# EAGLE design controller (EAGLE 9.6.0)
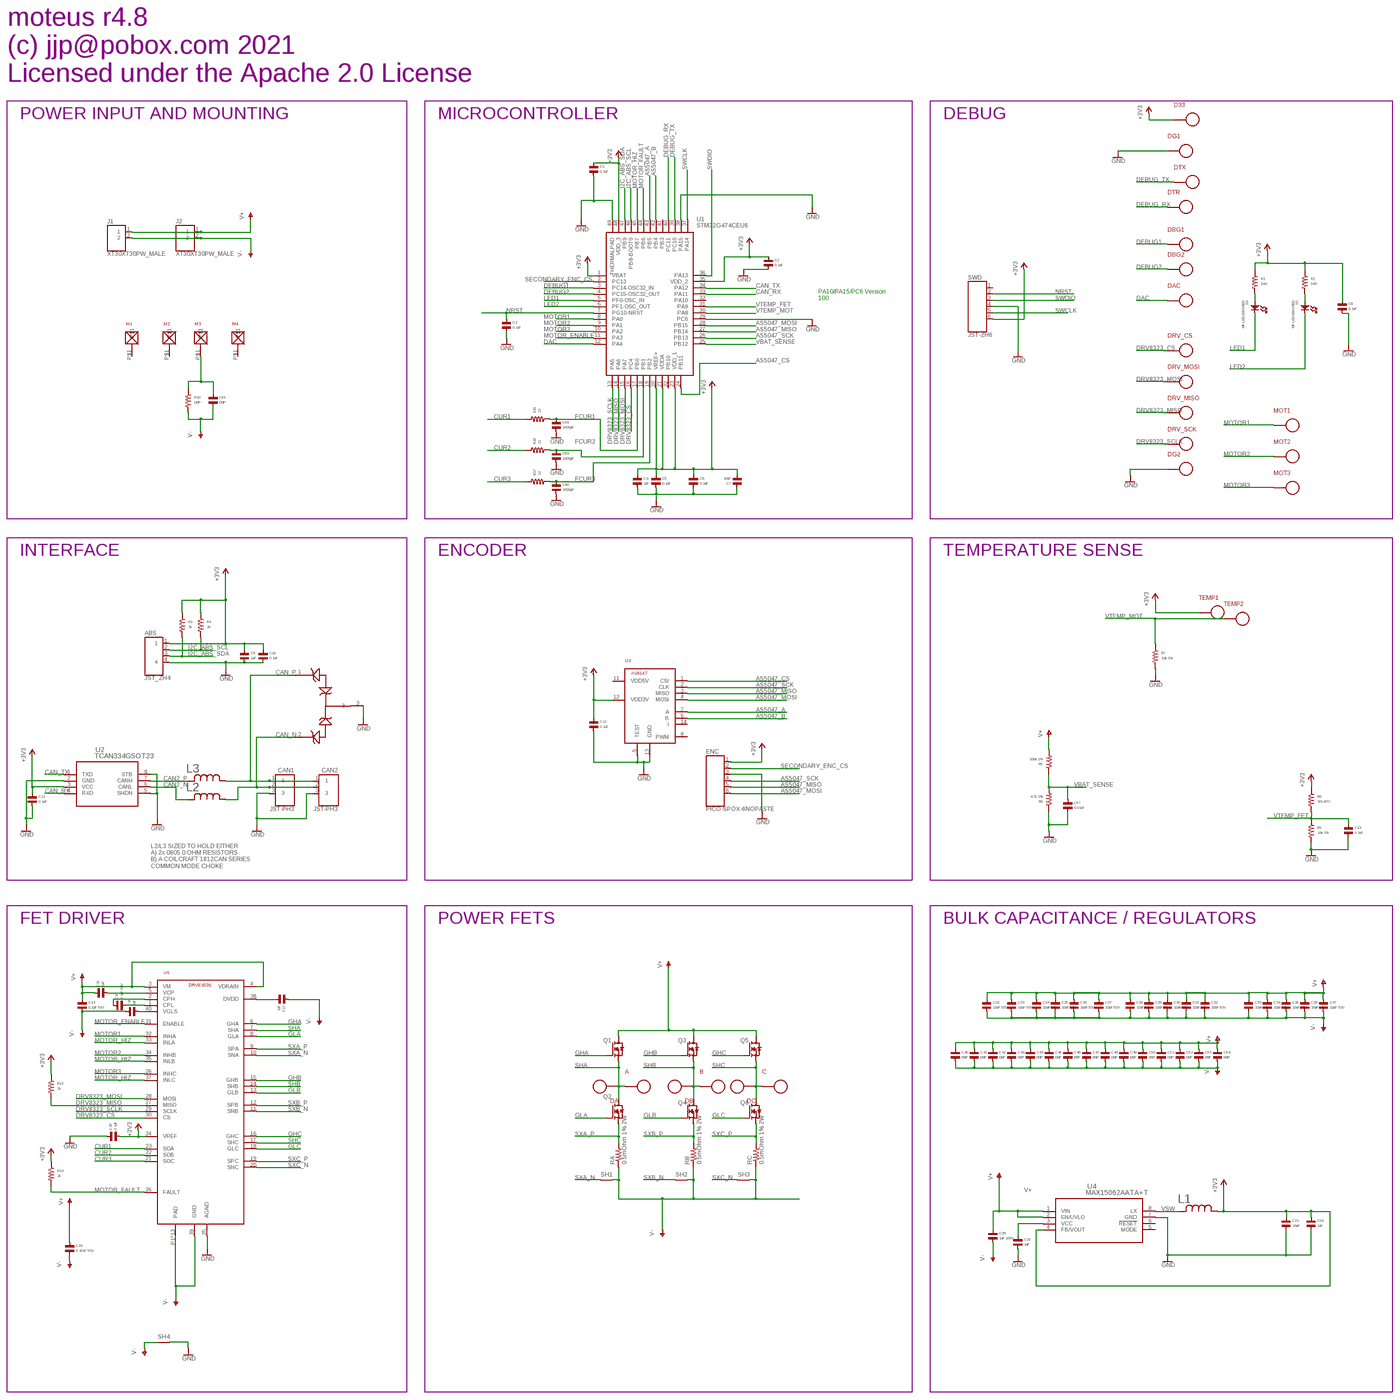
[diagram p0: schematic, sheet 1, overview]
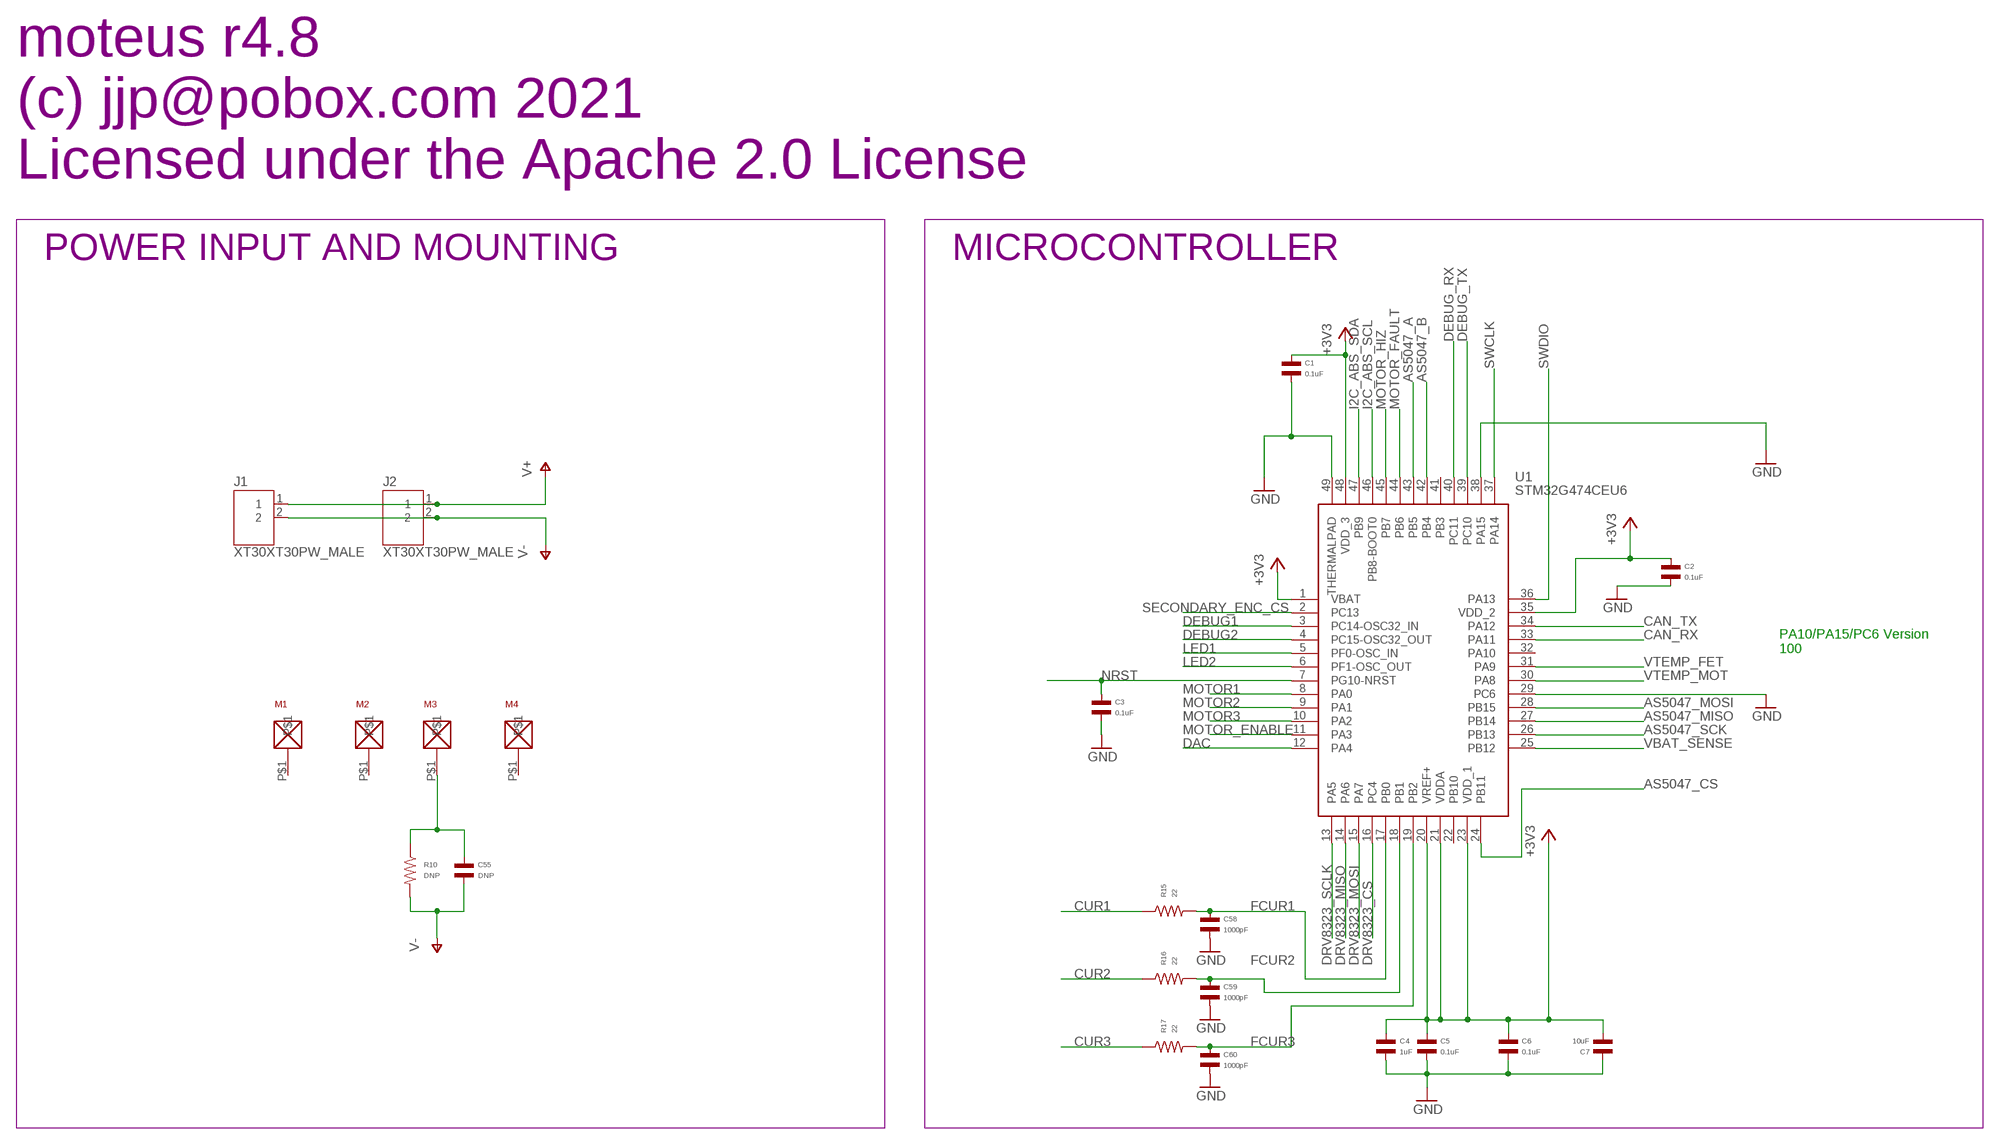
[diagram p1: schematic, sheet 1, part 1 of 4]
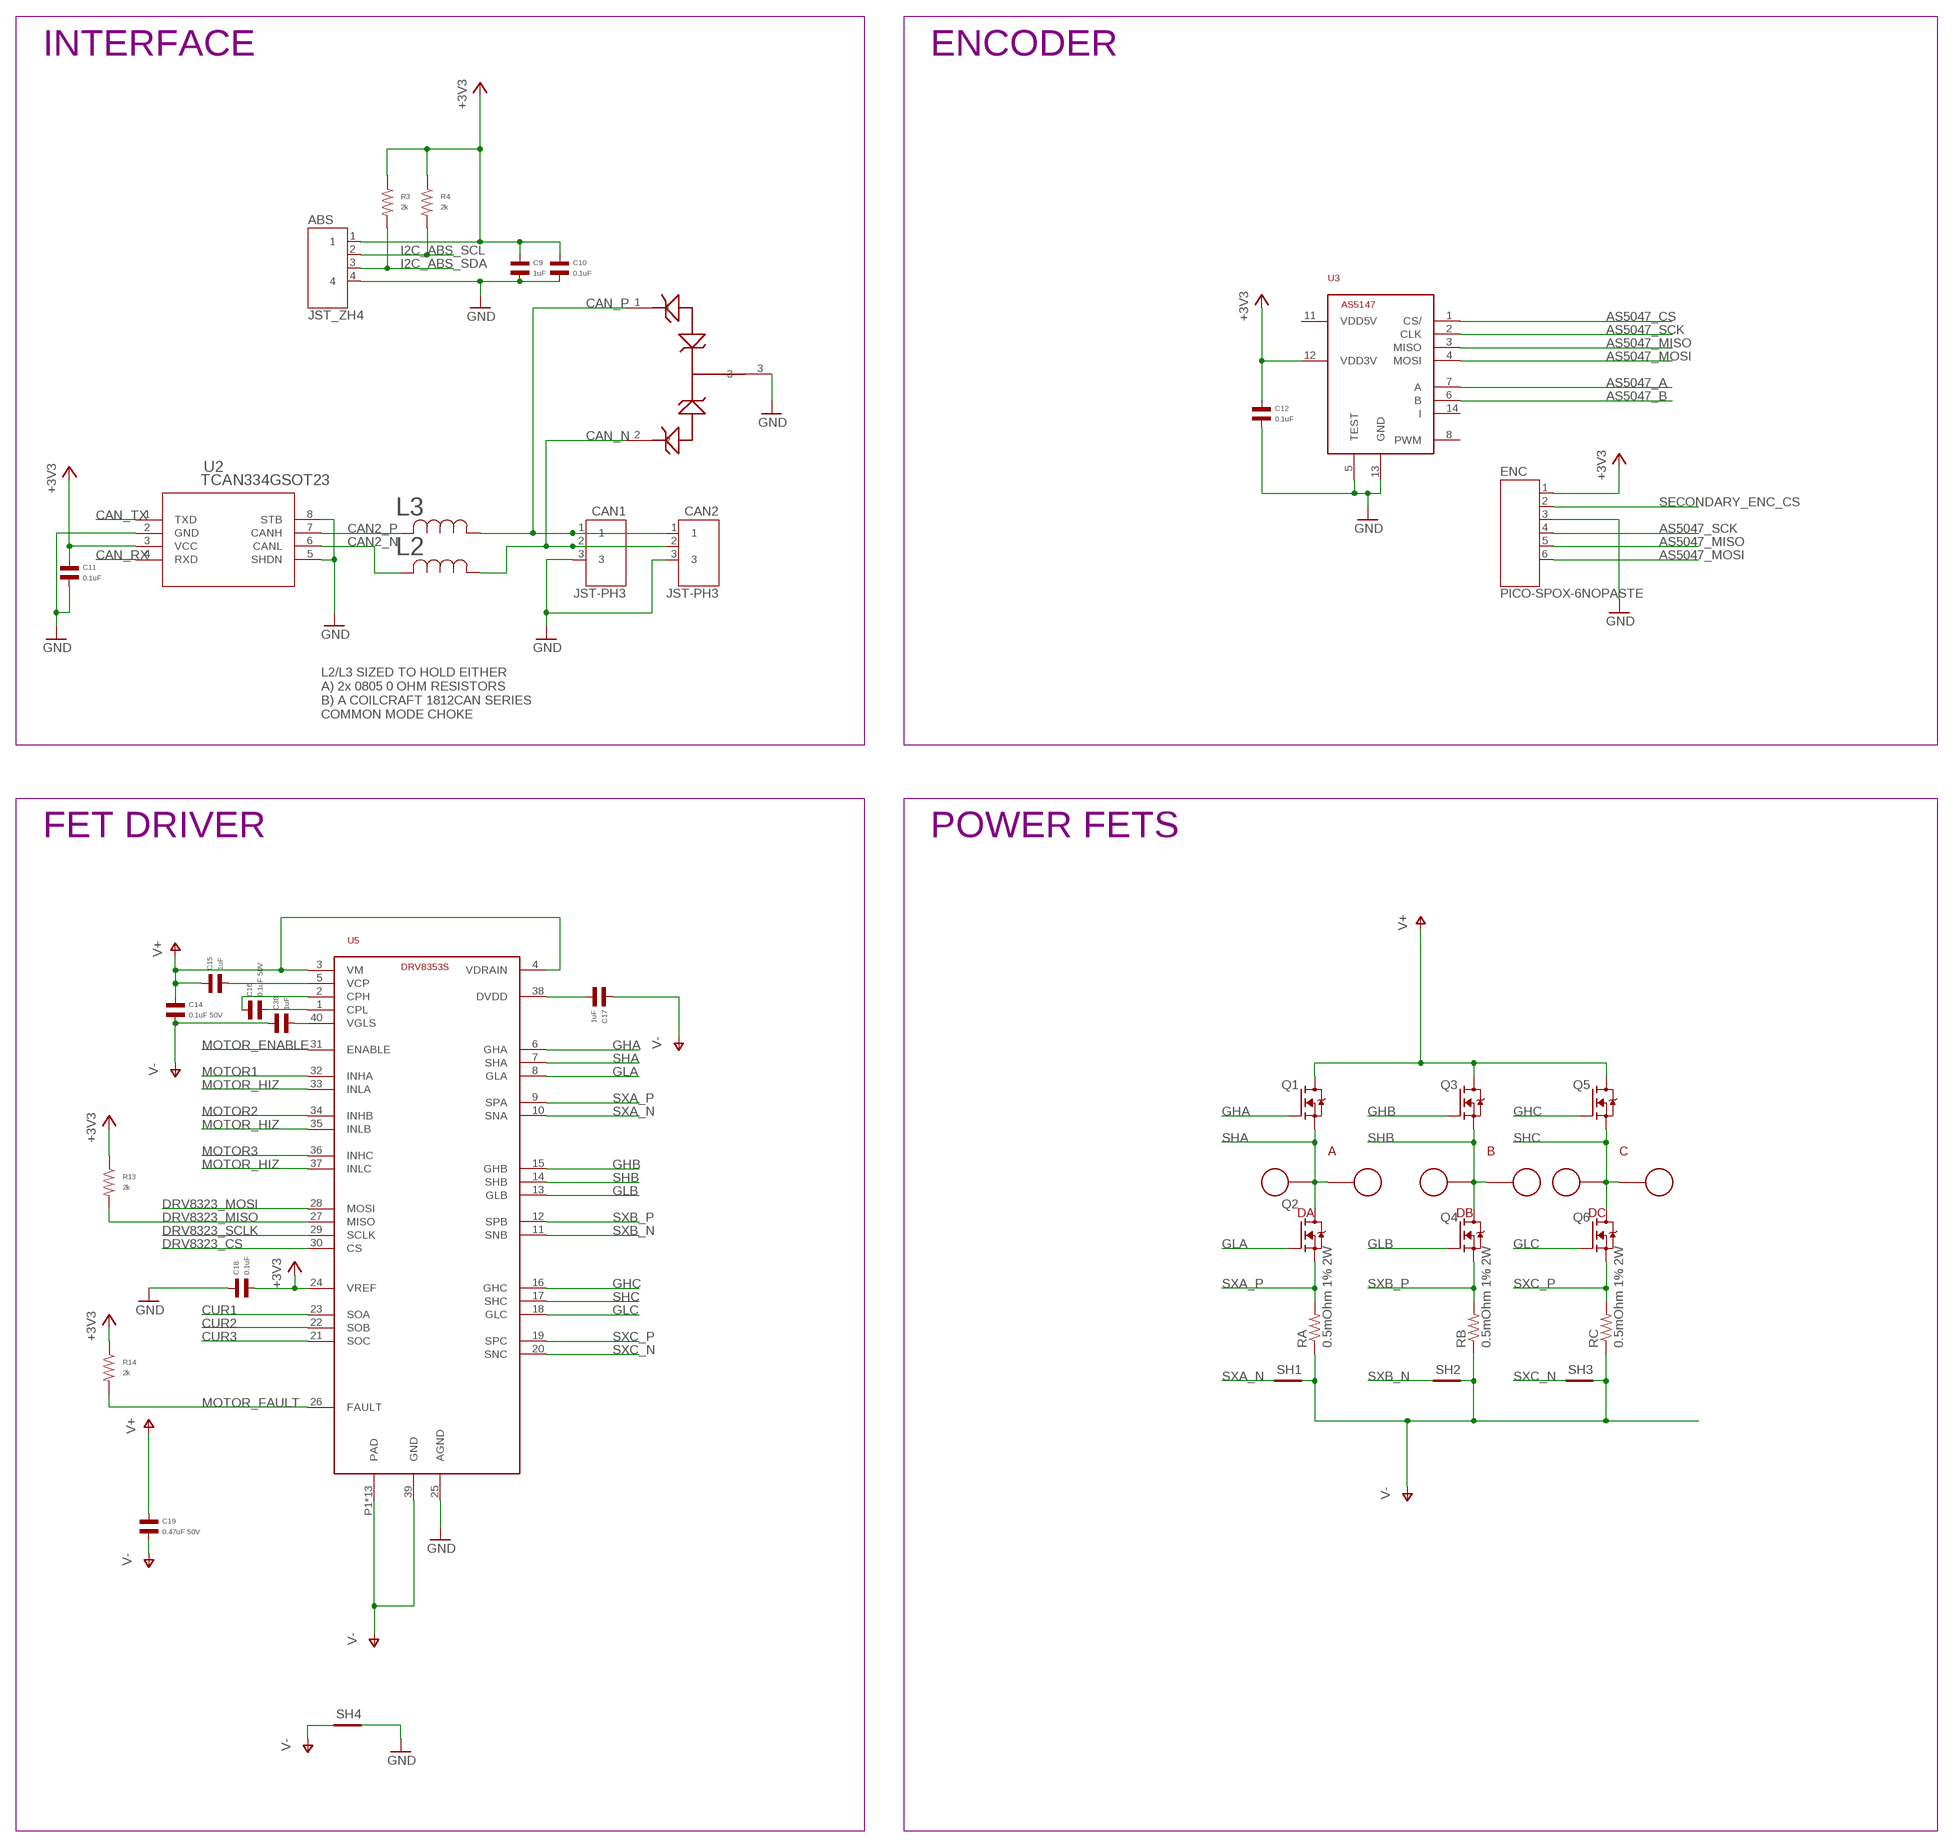
[diagram p2: schematic, sheet 1, part 2 of 4]
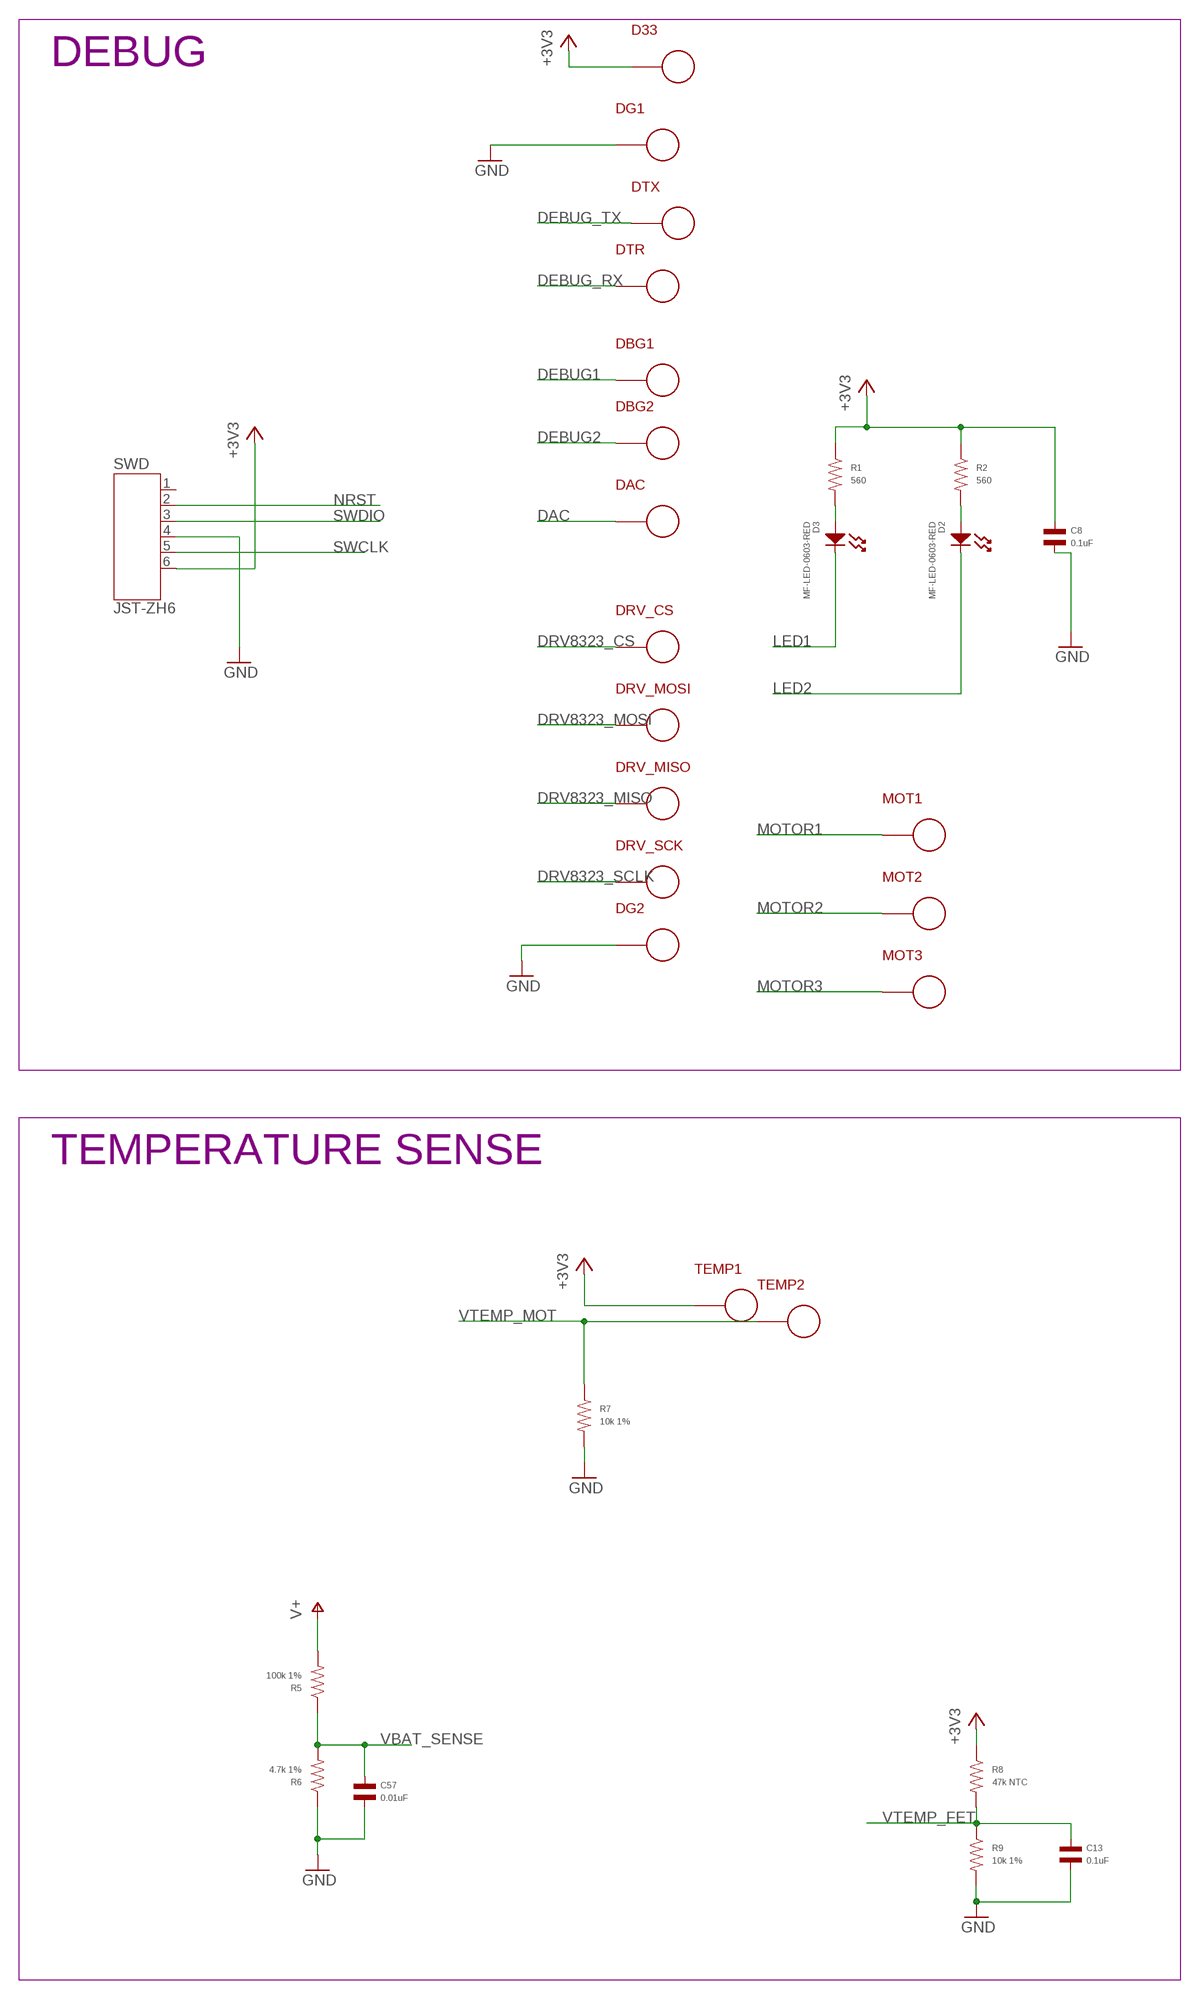
[diagram p3: schematic, sheet 1, part 3 of 4]
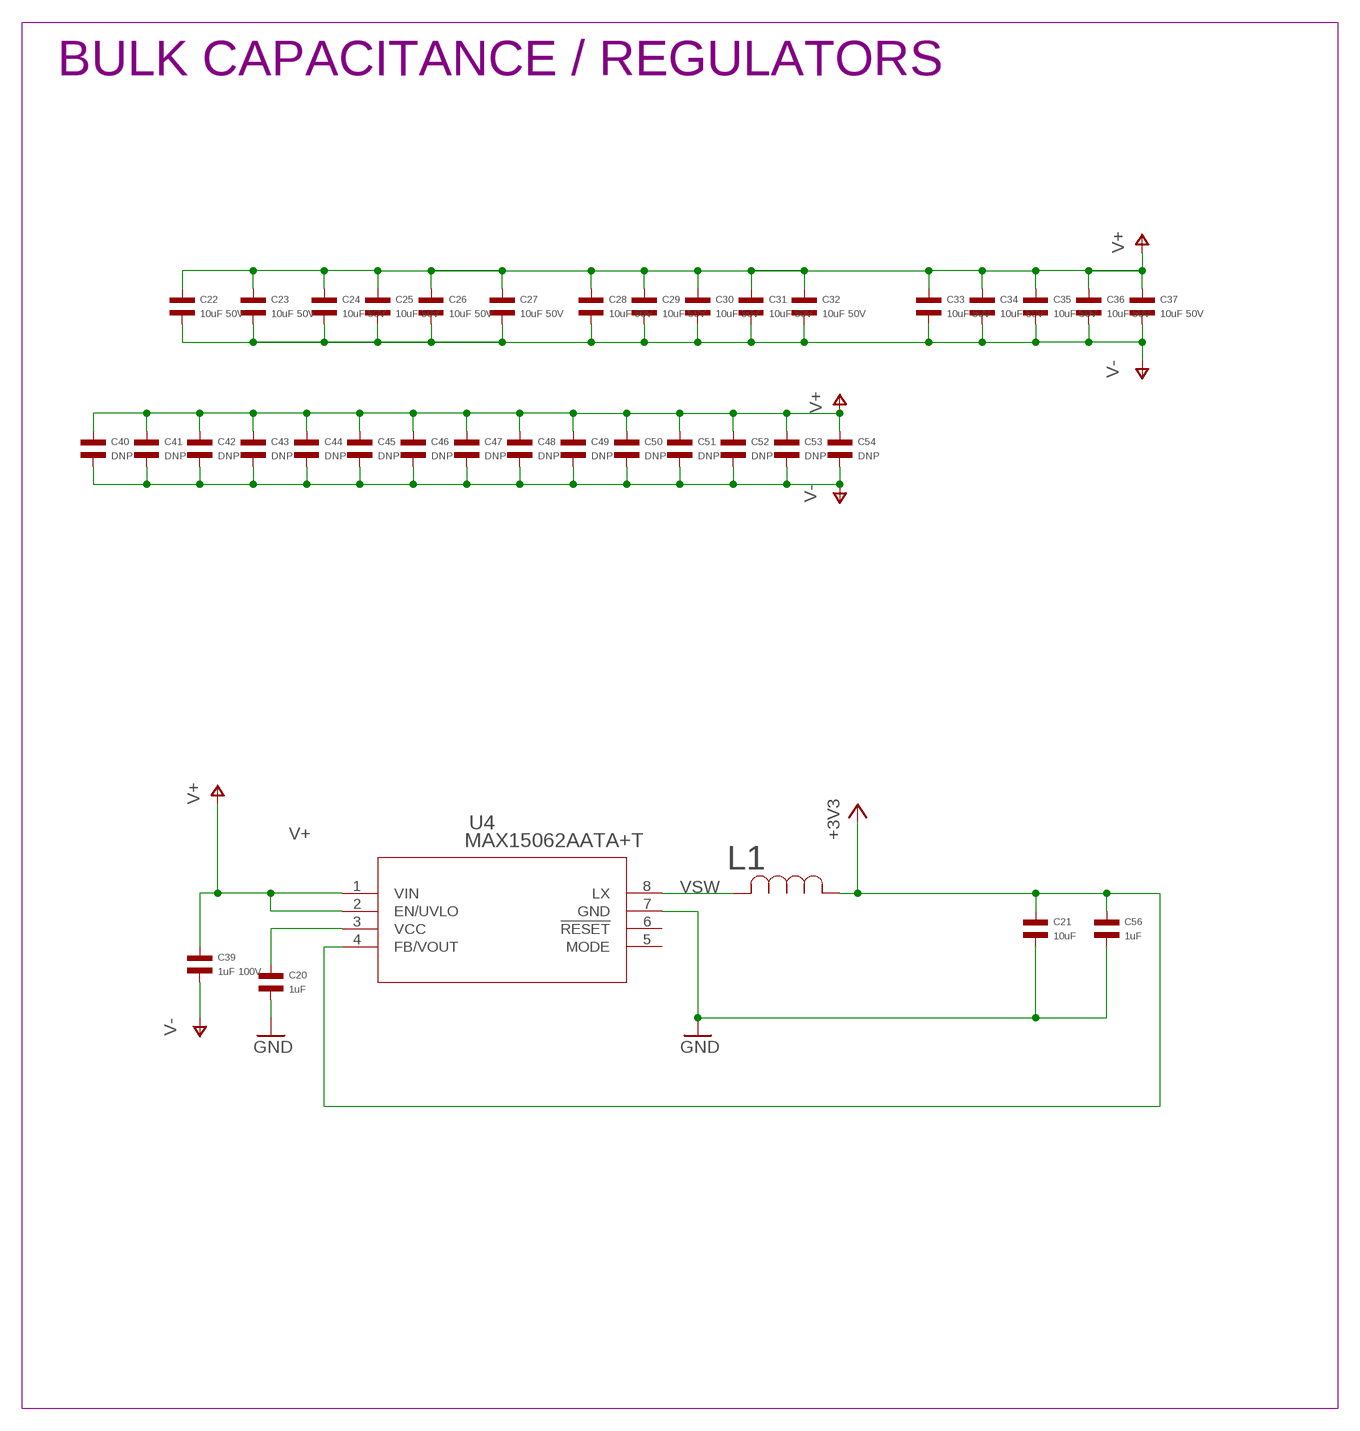
[diagram p4: schematic, sheet 1, part 4 of 4]

## Parts
A  PAD16AWG_PAD  [16AWG_PAD]
ABS  JST_ZH4  [JST_S4B-ZR-SM4A-TF(LF)(SN)]
B  PAD16AWG_PAD  [16AWG_PAD]
C  PAD16AWG_PAD  [16AWG_PAD]
C1  0.1uF  CAPACITOR_NP_0402  [C0402]
C2  0.1uF  CAPACITOR_NP_0402  [C0402]
C3  0.1uF  CAPACITOR_NP_0402  [C0402]
C4  1uF  CAPACITOR_NP_0402  [C0402]
C5  0.1uF  CAPACITOR_NP_0402  [C0402]
C6  0.1uF  CAPACITOR_NP_0402  [C0402]
C7  10uF  CAPACITOR_NP_1206  [C1206]
C8  0.1uF  CAPACITOR_NP_0402  [C0402]
C9  1uF  CAPACITOR_NP_0402  [C0402]
C10  0.1uF  CAPACITOR_NP_0402  [C0402]
C11  0.1uF  CAPACITOR_NP_0402  [C0402]
C12  0.1uF  CAPACITOR_NP_0402  [C0402]
C13  0.1uF  CAPACITOR_NP_0402  [C0402]
C14  0.1uF 50V  CAPACITOR_NP_0402  [C0402]
C15  1uF  CAPACITOR_NP_0402  [C0402]
C16  0.1uF 50V  CAPACITOR_NP_0402  [C0402]
C17  1uF  CAPACITOR_NP_0402  [C0402]
C18  0.1uF  CAPACITOR_NP_0402  [C0402]
C19  0.47uF 50V  CAPACITOR_NP_0402  [C0402]
C20  1uF  CAPACITOR_NP_0603  [C0603]
C21  10uF  CAPACITOR_NP_1206  [C1206]
C22  10uF 50V  CAPACITOR_NP_1206  [C1206]
C23  10uF 50V  CAPACITOR_NP_1206  [C1206]
C24  10uF 50V  CAPACITOR_NP_1206  [C1206]
C25  10uF 50V  CAPACITOR_NP_1206  [C1206]
C26  10uF 50V  CAPACITOR_NP_1206  [C1206]
C27  10uF 50V  CAPACITOR_NP_1206  [C1206]
C28  10uF 50V  CAPACITOR_NP_1206  [C1206]
C29  10uF 50V  CAPACITOR_NP_1206  [C1206]
C30  10uF 50V  CAPACITOR_NP_1206  [C1206]
C31  10uF 50V  CAPACITOR_NP_1206  [C1206]
C32  10uF 50V  CAPACITOR_NP_1206  [C1206]
C33  10uF 50V  CAPACITOR_NP_1206  [C1206]
C34  10uF 50V  CAPACITOR_NP_1206  [C1206]
C35  10uF 50V  CAPACITOR_NP_1206_NOBORDER  [C1206_NOBORDER]
C36  10uF 50V  CAPACITOR_NP_1206  [C1206]
C37  10uF 50V  CAPACITOR_NP_1206  [C1206]
C38  1uF  CAPACITOR_NP_0402  [C0402]
C39  1uF 100V  CAPACITOR_NP_0805  [C0805]
C40  DNP  CAPACITOR_NP_1206_NOCREAM  [C1206_NOCREAM]
C41  DNP  CAPACITOR_NP_1206_NOCREAM  [C1206_NOCREAM]
C42  DNP  CAPACITOR_NP_1206_NOCREAM  [C1206_NOCREAM]
C43  DNP  CAPACITOR_NP_1206_NOCREAM  [C1206_NOCREAM]
C44  DNP  CAPACITOR_NP_1206_NOCREAM  [C1206_NOCREAM]
C45  DNP  CAPACITOR_NP_1206_NOCREAM  [C1206_NOCREAM]
C46  DNP  CAPACITOR_NP_1206_NOCREAM  [C1206_NOCREAM]
C47  DNP  CAPACITOR_NP_1206_NOCREAM  [C1206_NOCREAM]
C48  DNP  CAPACITOR_NP_1206_NOCREAM  [C1206_NOCREAM]
C49  DNP  CAPACITOR_NP_1206_NOCREAM  [C1206_NOCREAM]
C50  DNP  CAPACITOR_NP_1206_NOCREAM  [C1206_NOCREAM]
C51  DNP  CAPACITOR_NP_1206_NOCREAM  [C1206_NOCREAM]
C52  DNP  CAPACITOR_NP_1206_NOCREAM  [C1206_NOCREAM]
C53  DNP  CAPACITOR_NP_1206_NOCREAM  [C1206_NOCREAM]
C54  DNP  CAPACITOR_NP_1206_NOCREAM  [C1206_NOCREAM]
C55  DNP  CAPACITOR_NP_0402  [C0402]
C56  1uF  CAPACITOR_NP_0402  [C0402]
C57  0.01uF  CAPACITOR_NP_0402  [C0402]
C58  1000pF  CAPACITOR_NP_0402  [C0402]
C59  1000pF  CAPACITOR_NP_0402  [C0402]
C60  1000pF  CAPACITOR_NP_0402  [C0402]
CAN1  JST-PH3  [JST_S3B-PH-SM4-TB(LF)(SN)]
CAN2  JST-PH3  [JST_S3B-PH-SM4-TB(LF)(SN)]
D2  MF-LED-0603-RED  LED_SINGLE-0603-RED  [LED0603]
D3  MF-LED-0603-RED  LED_SINGLE-0603-RED  [LED0603]
D4  DUAL_TVS  [SOT23-3]
D33  PAD24AWG_PAD  [24AWG_PAD]
DA  PAD24AWG_PAD  [24AWG_PAD]
DAC  PAD24AWG_PAD  [24AWG_PAD]
DB  PAD24AWG_PAD  [24AWG_PAD]
DBG1  PAD24AWG_PAD  [24AWG_PAD]
DBG2  PAD24AWG_PAD  [24AWG_PAD]
DC  PAD24AWG_PAD  [24AWG_PAD]
DG1  PAD24AWG_PAD  [24AWG_PAD]
DG2  PAD24AWG_PAD  [24AWG_PAD]
DRV_CS  PAD24AWG_PAD  [24AWG_PAD]
DRV_MISO  PAD24AWG_PAD  [24AWG_PAD]
DRV_MOSI  PAD24AWG_PAD  [24AWG_PAD]
DRV_SCK  PAD24AWG_PAD  [24AWG_PAD]
DTR  PAD24AWG_PAD  [24AWG_PAD]
DTX  PAD24AWG_PAD  [24AWG_PAD]
ENC  PICO-SPOX-6NOPASTE  [PICO-SPOX-SMT-RA-6-NOPASTE]
J1  XT30XT30PW_MALE  [XT30PW_MALE]
J2  XT30XT30PW_MALE  [XT30PW_MALE]
L1  SRN4018-220M  [IND_BOURNS_SRN4018]
L2  HALF_CHOKE  [1812_COMMON_HALF]
L3  HALF_CHOKE  [1812_COMMON_HALF]
M1  MOUNT  [M2.5MOUNT]
M2  MOUNT  [M2.5MOUNT]
M3  MOUNT  [M2.5MOUNT]
M4  MOUNT  [M2.5MOUNT]
MOT1  PAD24AWG_PAD  [24AWG_PAD]
MOT2  PAD24AWG_PAD  [24AWG_PAD]
MOT3  PAD24AWG_PAD  [24AWG_PAD]
Q1  TPH1R204PLSOP_ADVANCE_8  [SOP_ADVANCE_8]
Q2  TPH1R204PLSOP_ADVANCE_8  [SOP_ADVANCE_8]
Q3  TPH1R204PLSOP_ADVANCE_8  [SOP_ADVANCE_8]
Q4  TPH1R204PLSOP_ADVANCE_8  [SOP_ADVANCE_8]
Q5  TPH1R204PLSOP_ADVANCE_8  [SOP_ADVANCE_8]
Q6  TPH1R204PLSOP_ADVANCE_8  [SOP_ADVANCE_8]
R1  560  RESISTOR_0402  [R0402]
R2  560  RESISTOR_0402  [R0402]
R3  2k  RESISTOR_0402  [R0402]
R4  2k  RESISTOR_0402  [R0402]
R5  100k 1%  RESISTOR_0402  [R0402]
R6  4.7k 1%  RESISTOR_0402  [R0402]
R7  10k 1%  RESISTOR_0402  [R0402]
R8  47k NTC  RESISTOR_0402  [R0402]
R9  10k 1%  RESISTOR_0402  [R0402]
R10  DNP  RESISTOR_0402  [R0402]
R13  2k  RESISTOR_0402  [R0402]
R14  2k  RESISTOR_0402  [R0402]
R15  22  RESISTOR_0402  [R0402]
R16  22  RESISTOR_0402  [R0402]
R17  22  RESISTOR_0402  [R0402]
RA  0.5mOhm 1% 2W  R-US_M1206  [M1206]
RB  0.5mOhm 1% 2W  R-US_M1206  [M1206]
RC  0.5mOhm 1% 2W  R-US_M1206  [M1206]
SH1  SHORTT5  [SHORT_TOP-50]
SH2  SHORTT5  [SHORT_TOP-50]
SH3  SHORTT5  [SHORT_TOP-50]
SH4  SHORTMEDIUM  [SHORT_TOP-MEDIUM]
SWD  JST-ZH6  [JST_S6B-ZR-SM4A-TF(LF)(SN)]
TEMP1  PAD24AWG_PAD  [24AWG_PAD]
TEMP2  PAD24AWG_PAD  [24AWG_PAD]
U1  STM32G474CEU6  [QFN50P700X700X60-49N]
U2  TCAN334GSOT23  [SOT23-8]
U3  AS5147  [TSSOP14]
U4  MAX15062AATA+T  [21-0487A_MXM]
U5  DRV8353S  [WQFN-40]

## Nets
+3V3: ABS.1 C1.P$1 C2.P$1 C4.P$1 C5.P$1 C6.P$1 C7.P$2 C8.P$1 C9.P$1 C10.P$1 C11.P$1 C12.P$1 C18.P$2 C21.P$1 C56.P$1 D33.P$1 ENC.1 L1.1 R1.P$1 R2.P$1 R3.P$1 R4.P$1 R8.P$1 R13.P$1 R14.P$1 SWD.6 TEMP1.P$1 U1.1(VBAT) U1.20(VREF+) U1.21(VDDA) U1.23(VDD_1) U1.35(VDD_2) U1.48(VDD_3) U2.3(VCC) U3.12(VDD3V) U4.4(FB/VOUT) U5.24(VREF)
AS5047_A: U1.43(PB5) U3.7(A)
AS5047_B: U1.42(PB4) U3.6(B)
AS5047_CS: U1.24(PB11) U3.1(CS/)
AS5047_MISO: ENC.5 U1.27(PB14) U3.3(MISO)
AS5047_MOSI: ENC.6 U1.28(PB15) U3.4(MOSI)
AS5047_SCK: ENC.4 U1.26(PB13) U3.2(CLK)
CAN2_N: L2.P$2 U2.6(CANL)
CAN2_P: L3.P$2 U2.7(CANH)
CAN_N [CAN]: CAN1.2 CAN2.2 D4.2 L2.P$1
CAN_P [CAN]: CAN1.1 CAN2.1 D4.1 L3.P$1
CAN_RX: U1.33(PA11) U2.4(RXD)
CAN_TX: U1.34(PA12) U2.1(TXD)
CUR1: R15.P$1 U5.23(SOA)
CUR2: R16.P$1 U5.22(SOB)
CUR3: R17.P$1 U5.21(SOC)
DAC: DAC.P$1 U1.12(PA4)
DEBUG1: DBG1.P$1 U1.3(PC14-OSC32_IN)
DEBUG2: DBG2.P$1 U1.4(PC15-OSC32_OUT)
DEBUG_RX: DTR.P$1 U1.40(PC11)
DEBUG_TX: DTX.P$1 U1.39(PC10)
DRV8323_CS: DRV_CS.P$1 U1.16(PC4) U5.30(CS)
DRV8323_MISO: DRV_MISO.P$1 R13.P$2 U1.14(PA6) U5.27(MISO)
DRV8323_MOSI: DRV_MOSI.P$1 U1.15(PA7) U5.28(MOSI)
DRV8323_SCLK: DRV_SCK.P$1 U1.13(PA5) U5.29(SCLK)
FCUR1: C58.P$1 R15.P$2 U1.17(PB0)
FCUR2: C59.P$1 R16.P$2 U1.18(PB1)
FCUR3: C60.P$1 R17.P$2 U1.19(PB2)
GHA: Q1.4(G) U5.6(GHA)
GHB: Q3.4(G) U5.15(GHB)
GHC: Q5.4(G) U5.16(GHC)
GLA: Q2.4(G) U5.8(GLA)
GLB: Q4.4(G) U5.13(GLB)
GLC: Q6.4(G) U5.18(GLC)
GND: ABS.4 C1.P$2 C2.P$2 C3.P$2 C4.P$2 C5.P$2 C6.P$2 C7.P$1 C8.P$2 C9.P$2 C10.P$2 C11.P$2 C12.P$2 C13.P$2 C18.P$1 C20.P$2 C21.P$2 C56.P$2 C57.P$2 C58.P$2 C59.P$2 C60.P$2 CAN1.3 CAN2.3 D4.3 DG1.P$1 DG2.P$1 ENC.3 R6.P$1 R7.P$2 R9.P$2 SH4.2 SWD.4 U1.29(PC6) U1.38(PA15) U1.49(THERMALPAD) U2.2(GND) U2.5(SHDN) U2.8(STB) U3.5(TEST) U3.13(GND) U4.7(GND) U5.25(AGND)
I2C_ABS_SCL: ABS.2 R4.P$2 U1.46(PB8-BOOT0)
I2C_ABS_SDA: ABS.3 R3.P$2 U1.47(PB9)
LED1: D3.CATHODE U1.5(PF0-OSC_IN)
LED2: D2.CATHODE U1.6(PF1-OSC_OUT)
MOTOR1: MOT1.P$1 U1.8(PA0) U5.32(INHA)
MOTOR2: MOT2.P$1 U1.9(PA1) U5.34(INHB)
MOTOR3: MOT3.P$1 U1.10(PA2) U5.36(INHC)
MOTOR_ENABLE: U1.11(PA3) U5.31(ENABLE)
MOTOR_FAULT: R14.P$2 U1.44(PB6) U5.26(FAULT)
MOTOR_HIZ: U1.45(PB7) U5.33(INLA) U5.35(INLB) U5.37(INLC)
N$1: C55.P$1 M3.P$1 R10.P$1
N$2: C38.P$2 U5.40(VGLS)
N$4: C20.P$1 U4.3(VCC)
N$10: C16.P$2 U5.1(CPL)
N$13: C16.P$1 U5.2(CPH)
N$14: C15.P$2 U5.5(VCP)
N$16: C17.P$2 U5.38(DVDD)
N$17: D3.ANODE R1.P$2
N$18: D2.ANODE R2.P$2
NRST: C3.P$1 SWD.2 U1.7(PG10-NRST)
SECONDARY_ENC_CS: ENC.2 U1.2(PC13)
SHA: A.1 DA.P$1 Q1.1(S) Q1.2(S) Q1.3(S) Q2.5(D) Q2.6(D) Q2.7(D) Q2.8(D) Q2.PAD(D) U5.7(SHA)
SHB: B.1 DB.P$1 Q3.1(S) Q3.2(S) Q3.3(S) Q4.5(D) Q4.6(D) Q4.7(D) Q4.8(D) Q4.PAD(D) U5.14(SHB)
SHC: C.1 DC.P$1 Q5.1(S) Q5.2(S) Q5.3(S) Q6.5(D) Q6.6(D) Q6.7(D) Q6.8(D) Q6.PAD(D) U5.17(SHC)
SWCLK: SWD.5 U1.37(PA14)
SWDIO: SWD.3 U1.36(PA13)
SXA_N: SH1.1 U5.10(SNA)
SXA_P: Q2.1(S) Q2.2(S) Q2.3(S) RA.2 U5.9(SPA)
SXB_N: SH2.1 U5.11(SNB)
SXB_P: Q4.1(S) Q4.2(S) Q4.3(S) RB.2 U5.12(SPB)
SXC_N: SH3.1 U5.20(SNC)
SXC_P: Q6.1(S) Q6.2(S) Q6.3(S) RC.2 U5.19(SPC)
V+: C14.P$1 C15.P$1 C19.P$1 C22.P$1 C23.P$1 C24.P$1 C25.P$1 C26.P$1 C27.P$1 C28.P$1 C29.P$1 C30.P$1 C31.P$1 C32.P$1 C33.P$1 C34.P$1 C35.P$1 C36.P$1 C37.P$1 C39.P$1 C40.P$1 C41.P$1 C42.P$1 C43.P$1 C44.P$1 C45.P$1 C46.P$1 C47.P$1 C48.P$1 C49.P$1 C50.P$1 C51.P$1 C52.P$1 C53.P$1 C54.P$1 J1.1 J2.1 Q1.5(D) Q1.6(D) Q1.7(D) Q1.8(D) Q1.PAD(D) Q3.5(D) Q3.6(D) Q3.7(D) Q3.8(D) Q3.PAD(D) Q5.5(D) Q5.6(D) Q5.7(D) Q5.8(D) Q5.PAD(D) R5.P$2 U4.1(VIN) U4.2(EN/UVLO) U5.3(VM) U5.4(VDRAIN)
V-: C14.P$2 C17.P$1 C19.P$2 C22.P$2 C23.P$2 C24.P$2 C25.P$2 C26.P$2 C27.P$2 C28.P$2 C29.P$2 C30.P$2 C31.P$2 C32.P$2 C33.P$2 C34.P$2 C35.P$2 C36.P$2 C37.P$2 C38.P$1 C39.P$2 C40.P$2 C41.P$2 C42.P$2 C43.P$2 C44.P$2 C45.P$2 C46.P$2 C47.P$2 C48.P$2 C49.P$2 C50.P$2 C51.P$2 C52.P$2 C53.P$2 C54.P$2 C55.P$2 J1.2 J2.2 R10.P$2 RA.1 RB.1 RC.1 SH1.2 SH2.2 SH3.2 SH4.1 U5.39(GND) U5.P1(PAD) U5.P2(PAD) U5.P3(PAD) U5.P7(PAD) U5.P8(PAD) U5.P9(PAD) U5.P12(PAD) U5.P13(PAD) U5.P14(PAD) U5.P17(PAD) U5.P18(PAD) U5.P19(PAD) U5.PAD
VBAT_SENSE: C57.P$1 R5.P$1 R6.P$2 U1.25(PB12)
VSW: L1.2 U4.8(LX)
VTEMP_FET: C13.P$1 R8.P$2 R9.P$1 U1.31(PA9)
VTEMP_MOT: R7.P$1 TEMP2.P$1 U1.30(PA8)
Unconnected: M1.P$1 M2.P$1 M4.P$1 SWD.1 U1.22(PB10) U1.32(PA10) U1.41(PB3) U3.8(PWM) U3.11(VDD5V) U3.14(I) U4.5(MODE) U4.6(!RESET)

## Notes on the sheet
- moteus r4.8
  (c) jjp@pobox.com 2021
  Licensed under the Apache 2.0 License
- POWER INPUT AND MOUNTING | MICROCONTROLLER | DEBUG
- PA10/PA15/PC6 Version
  100
- INTERFACE | ENCODER | TEMPERATURE SENSE
- L2/L3 SIZED TO HOLD EITHER
  A) 2x 0805 0 OHM RESISTORS
  B) A COILCRAFT 1812CAN SERIES
  COMMON MODE CHOKE
- FET DRIVER | POWER FETS | BULK CAPACITANCE / REGULATORS

## Library data of the parts
A B C D33 DA DAC DB DBG1 DBG2 DC DG1 DG2 DRV_CS DRV_MISO DRV_MOSI DRV_SCK DTR DTX MOT1-MOT3 TEMP1 TEMP2 = controller:PAD; POPULATE: 0
ABS = controller:JST_ZH4; MF: JST; MPN: S4B-ZR-SM4A-TF(LF)(SN); POPULATE: 1
C1-C3 C5 C6 C8 C10-C13 C18 = mfpassives:CAPACITOR_NP: Library: MF_Passives Description: Device for Non-Polarized Capacitors. Manufacture part number (MPN) can be added via Attributes. Check https://factory.macrofab.com/parts for the house parts list.; HOUSEPART: YES; MPN: MF-CAP-0402-0.1uF; POPULATE: 1
C4 C9 C15 C17 C38 C56 = mfpassives:CAPACITOR_NP: Library: MF_Passives Description: Device for Non-Polarized Capacitors. Manufacture part number (MPN) can be added via Attributes. Check https://factory.macrofab.com/parts for the house parts list.; HOUSEPART: YES; MPN: MF-CAP-0402-1uF; POPULATE: 1
C7 = mfpassives:CAPACITOR_NP: Library: MF_Passives Description: Device for Non-Polarized Capacitors. Manufacture part number (MPN) can be added via Attributes. Check https://factory.macrofab.com/parts for the house parts list.; HOUSEPART: YES; MPN: MF-CAP-1206-10uF; POPULATE: 1
C14 C16 = mfpassives:CAPACITOR_NP: Library: MF_Passives Description: Device for Non-Polarized Capacitors. Manufacture part number (MPN) can be added via Attributes. Check https://factory.macrofab.com/parts for the house parts list.; MF: TDK; MPN: CGA2B3X7R1H104K050BB; POPULATE: 1
C19 = mfpassives:CAPACITOR_NP: Library: MF_Passives Description: Device for Non-Polarized Capacitors. Manufacture part number (MPN) can be added via Attributes. Check https://factory.macrofab.com/parts for the house parts list.; MF: Murata; MPN: GRM155R61H474KE11D; POPULATE: 1
C20 = mfpassives:CAPACITOR_NP: Library: MF_Passives Description: Device for Non-Polarized Capacitors. Manufacture part number (MPN) can be added via Attributes. Check https://factory.macrofab.com/parts for the house parts list.; HOUSEPART: 1; MPN: MF-CAP-0603-1uF; POPULATE: 1
C21 = mfpassives:CAPACITOR_NP: Library: MF_Passives Description: Device for Non-Polarized Capacitors. Manufacture part number (MPN) can be added via Attributes. Check https://factory.macrofab.com/parts for the house parts list.; HOUSEPART: 1; MPN: MF-CAP-1206-10uF; POPULATE: 1
C22-C34 C36 C37 = mfpassives:CAPACITOR_NP: Library: MF_Passives Description: Device for Non-Polarized Capacitors. Manufacture part number (MPN) can be added via Attributes. Check https://factory.macrofab.com/parts for the house parts list.; MF: TDK; MPN: C3216X7R1H106K160AE; POPULATE: 1
C35 = controller:CAPACITOR_NP: Library: MF_Passives Description: Device for Non-Polarized Capacitors. Manufacture part number (MPN) can be added via Attributes. Check https://factory.macrofab.com/parts for the house parts list.; MF: TDK; MPN: C3216X7R1H106K160AE; POPULATE: 1
C39 = mfpassives:CAPACITOR_NP: Library: MF_Passives Description: Device for Non-Polarized Capacitors. Manufacture part number (MPN) can be added via Attributes. Check https://factory.macrofab.com/parts for the house parts list.; MF: MURATA; MPN: GCM21BC72A105KE36L; POPULATE: 1
C40-C54 = controller:CAPACITOR_NP: Library: MF_Passives Description: Device for Non-Polarized Capacitors. Manufacture part number (MPN) can be added via Attributes. Check https://factory.macrofab.com/parts for the house parts list.; POPULATE: 0
C55 = mfpassives:CAPACITOR_NP: Library: MF_Passives Description: Device for Non-Polarized Capacitors. Manufacture part number (MPN) can be added via Attributes. Check https://factory.macrofab.com/parts for the house parts list.; POPULATE: 0
C57 = mfpassives:CAPACITOR_NP: Library: MF_Passives Description: Device for Non-Polarized Capacitors. Manufacture part number (MPN) can be added via Attributes. Check https://factory.macrofab.com/parts for the house parts list.; HOUSEPART: YES; MPN: MF-CAP-0402-0.01uF; POPULATE: 1
C58-C60 = mfpassives:CAPACITOR_NP: Library: MF_Passives Description: Device for Non-Polarized Capacitors. Manufacture part number (MPN) can be added via Attributes. Check https://factory.macrofab.com/parts for the house parts list.; HOUSEPART: 1; MPN: MF-CAP-0402-1nF; POPULATE: 1
CAN1 CAN2 = controller:JST-PH3; MF: JST; MPN: S3B-PH-SM4-TB(LF)(SN); POPULATE: 1
D2 = mfleds:LED_SINGLE: Library: MF_LEDs Description: Device for Single LED Packages. Manufacture part number (MFG#) can be added via Attributes.; HOUSEPART: YES; MPN: MF-LED-0603-GREEN; POPULATE: 1; URL: https://factory.macrofab.com/part/MF-LED-0603-RED
D3 = mfleds:LED_SINGLE: Library: MF_LEDs Description: Device for Single LED Packages. Manufacture part number (MFG#) can be added via Attributes.; HOUSEPART: YES; MPN: MF-LED-0603-RED; POPULATE: 1; URL: https://factory.macrofab.com/part/MF-LED-0603-RED
D4 = controller:DUAL_TVS; MPN: CDSOT23-0502B; POPULATE: 1
ENC = controller:PICO-SPOX-6; POPULATE: 0
J1 J2 = controller:XT30; POPULATE: 1
L1 = controller:SRN4018-220M; MANUFACTURER_PART_NUMBER: SRN4018-330M; MPN: SRN4018-330M; POPULATE: 1; VENDOR: Bourns Electronics
L2 L3 = controller:HALF_CHOKE; MPN: MF-RES-0805-0; POPULATE: 1
M1-M4 = controller:MOUNT; POPULATE: 0
Q1-Q6 = controller:TPH1R204PL; MF: Toshiba; MPN: TPH2R506PL,L1Q; POPULATE: 1
R1 R2 = mfpassives:RESISTOR: Library: MF_Passives Description: Device for Resistors. Manufacture part number (MPN), Voltage, Tolerance, and Wattage Rating can be added via Attributes. Check https://factory.macrofab.com/parts for the house parts list.; HOUSEPART: 1; MPN: MF-RES-0402-560; POPULATE: 1
R3 R4 R13 R14 = mfpassives:RESISTOR: Library: MF_Passives Description: Device for Resistors. Manufacture part number (MPN), Voltage, Tolerance, and Wattage Rating can be added via Attributes. Check https://factory.macrofab.com/parts for the house parts list.; HOUSEPART: YES; MPN: MF-RES-0402-2K; POPULATE: 1
R5 = mfpassives:RESISTOR: Library: MF_Passives Description: Device for Resistors. Manufacture part number (MPN), Voltage, Tolerance, and Wattage Rating can be added via Attributes. Check https://factory.macrofab.com/parts for the house parts list.; MF: Yageo; MPN: RC0402FR-07100KL; POPULATE: 1
R6 = mfpassives:RESISTOR: Library: MF_Passives Description: Device for Resistors. Manufacture part number (MPN), Voltage, Tolerance, and Wattage Rating can be added via Attributes. Check https://factory.macrofab.com/parts for the house parts list.; MF: Yageo; MPN: RC0402FR-074K7L; POPULATE: 1
R7 R9 = mfpassives:RESISTOR: Library: MF_Passives Description: Device for Resistors. Manufacture part number (MPN), Voltage, Tolerance, and Wattage Rating can be added via Attributes. Check https://factory.macrofab.com/parts for the house parts list.; MF: Yageo; MPN: RC0402FR-0710KL; POPULATE: 1
R8 = mfpassives:RESISTOR: Library: MF_Passives Description: Device for Resistors. Manufacture part number (MPN), Voltage, Tolerance, and Wattage Rating can be added via Attributes. Check https://factory.macrofab.com/parts for the house parts list.; MF: Murata; MPN: NCP15WB473F03RC; POPULATE: 1
R10 = mfpassives:RESISTOR: Library: MF_Passives Description: Device for Resistors. Manufacture part number (MPN), Voltage, Tolerance, and Wattage Rating can be added via Attributes. Check https://factory.macrofab.com/parts for the house parts list.; POPULATE: 0
R15-R17 = mfpassives:RESISTOR: Library: MF_Passives Description: Device for Resistors. Manufacture part number (MPN), Voltage, Tolerance, and Wattage Rating can be added via Attributes. Check https://factory.macrofab.com/parts for the house parts list.; HOUSEPART: 1; MPN: MF-RES-0402-22; POPULATE: 1
RA RB RC = rcl:R-US_: RESISTOR, American symbol; MF: Stackpole Electronics; MPN: HCS1206FTL500; POPULATE: 1
SH1-SH3 = shorts:SHORT: Short between two nets; BOM: no; POPULATE: 0
SH4 = shorts:SHORT: Short between two nets; POPULATE: 0
SWD = controller:JST-ZH6; MF: JST; MPN: S6B-ZR-SM4A-TF(LF)(SN); POPULATE: 1
U1 = controller:STM32G474CEU6: STMICROELECTRONICS - STM32G474CEU6 - MCU, 32BIT, 170MHZ, UFQFPN-48 Source: Datasheet <https://componentsearchengine.com/Datasheets/1/STM32G474CEU6.pdf>; DESCRIPTION: STMICROELECTRONICS - STM32G474CEU6 - MCU, 32BIT, 170MHZ, UFQFPN-48; HEIGHT: 0.6mm; MANUFACTURER_NAME: STMicroelectronics; MANUFACTURER_PART_NUMBER: STM32G474CEU6; MOUSER_PART_NUMBER: 511-STM32G474CEU6; MOUSER_PRICE-STOCK: https://www.mouser.com/Search/Refine.aspx?Keyword=511-STM32G474CEU6; MPN: STM32G474CEU6; POPULATE: 1
U2 = controller:TCAN334G; MF: TI; MPN: TCAN334GDCNT; POPULATE: 1
U3 = controller:AS5147; MF: AMS; MPN: AS5047P-ATSM; POPULATE: 1
U4 = power_dist:MAX15062AATA+T; BUILT_BY: EMA_Jessica; COPYRIGHT: Copyright (C) 2018 Accelerated Designs. All rights reserved; MANUFACTURER_PART_NUMBER: MAX15062AATA+T; MPN: MAX15062AATA+T; POPULATE: 1; REVISION: 1; SOURCELIBRARY: Maxim_DP_2018-06-12; VENDOR: Maxim Integrated Products
U5 = controller:DRV8353S; MF: TI; MPN: DRV8353FSRTAR; POPULATE: 1

## Net classes
0 default: width 0.127 mm
1 CAN: width 0.216 mm, clearance 0.127 mm

## Board
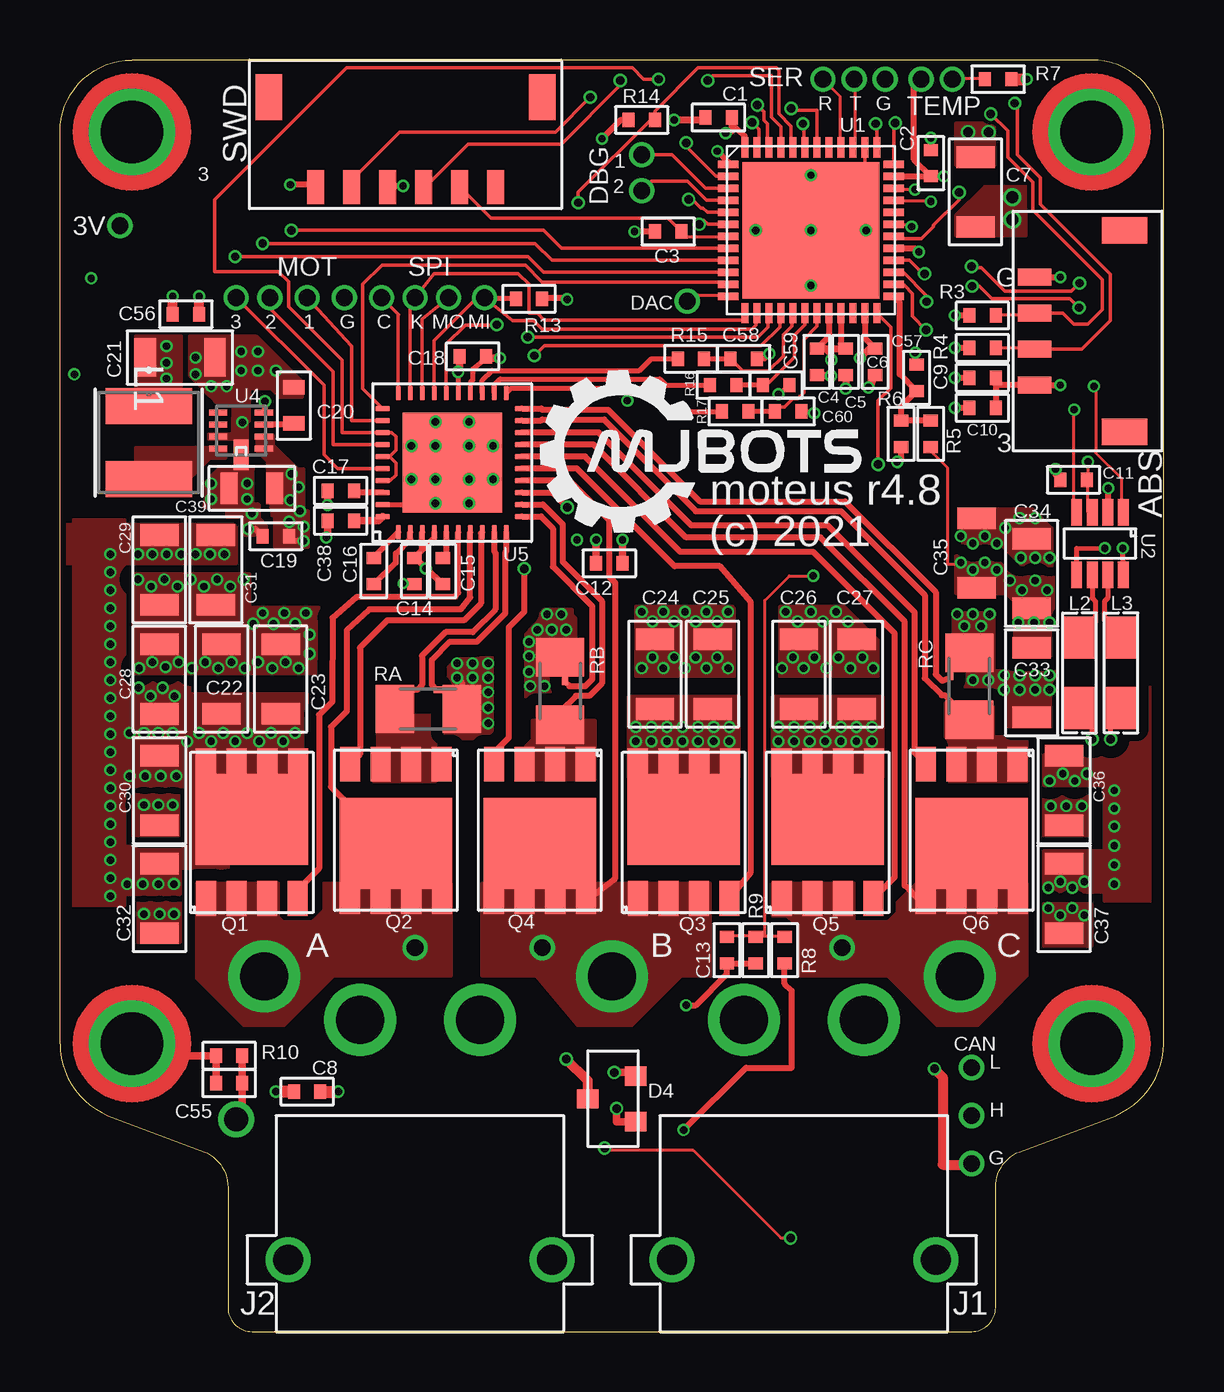
[diagram p5: board, top side]
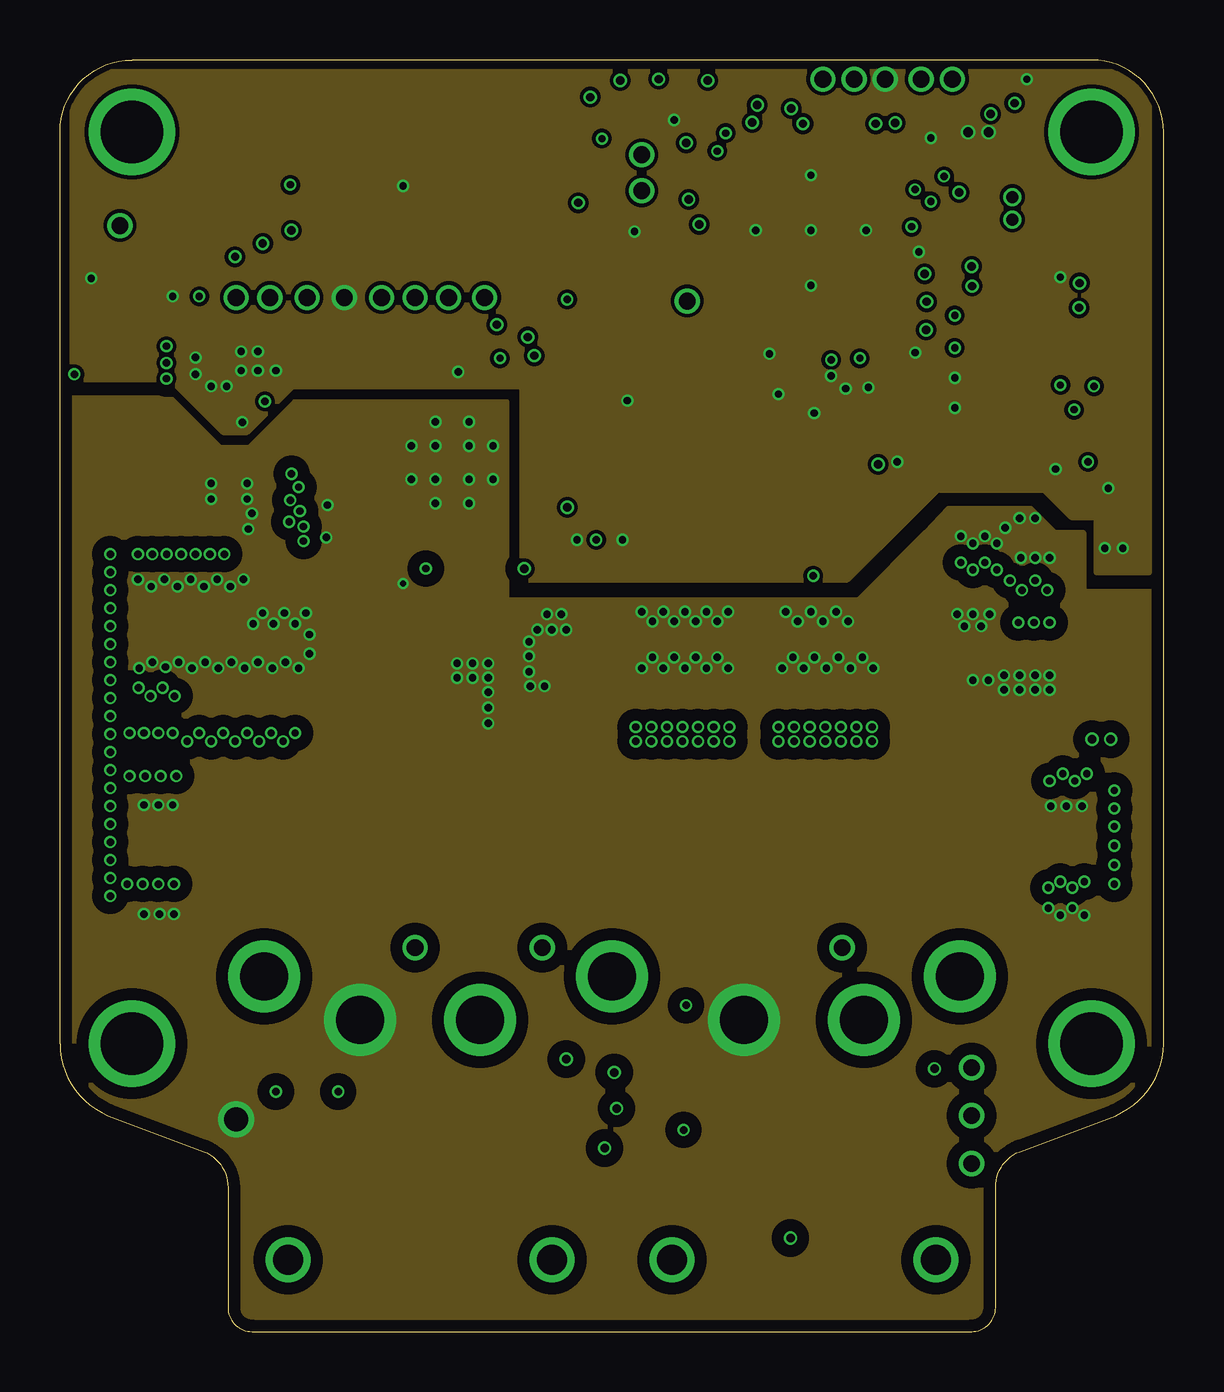
[diagram p6: board, inner layer Route2]
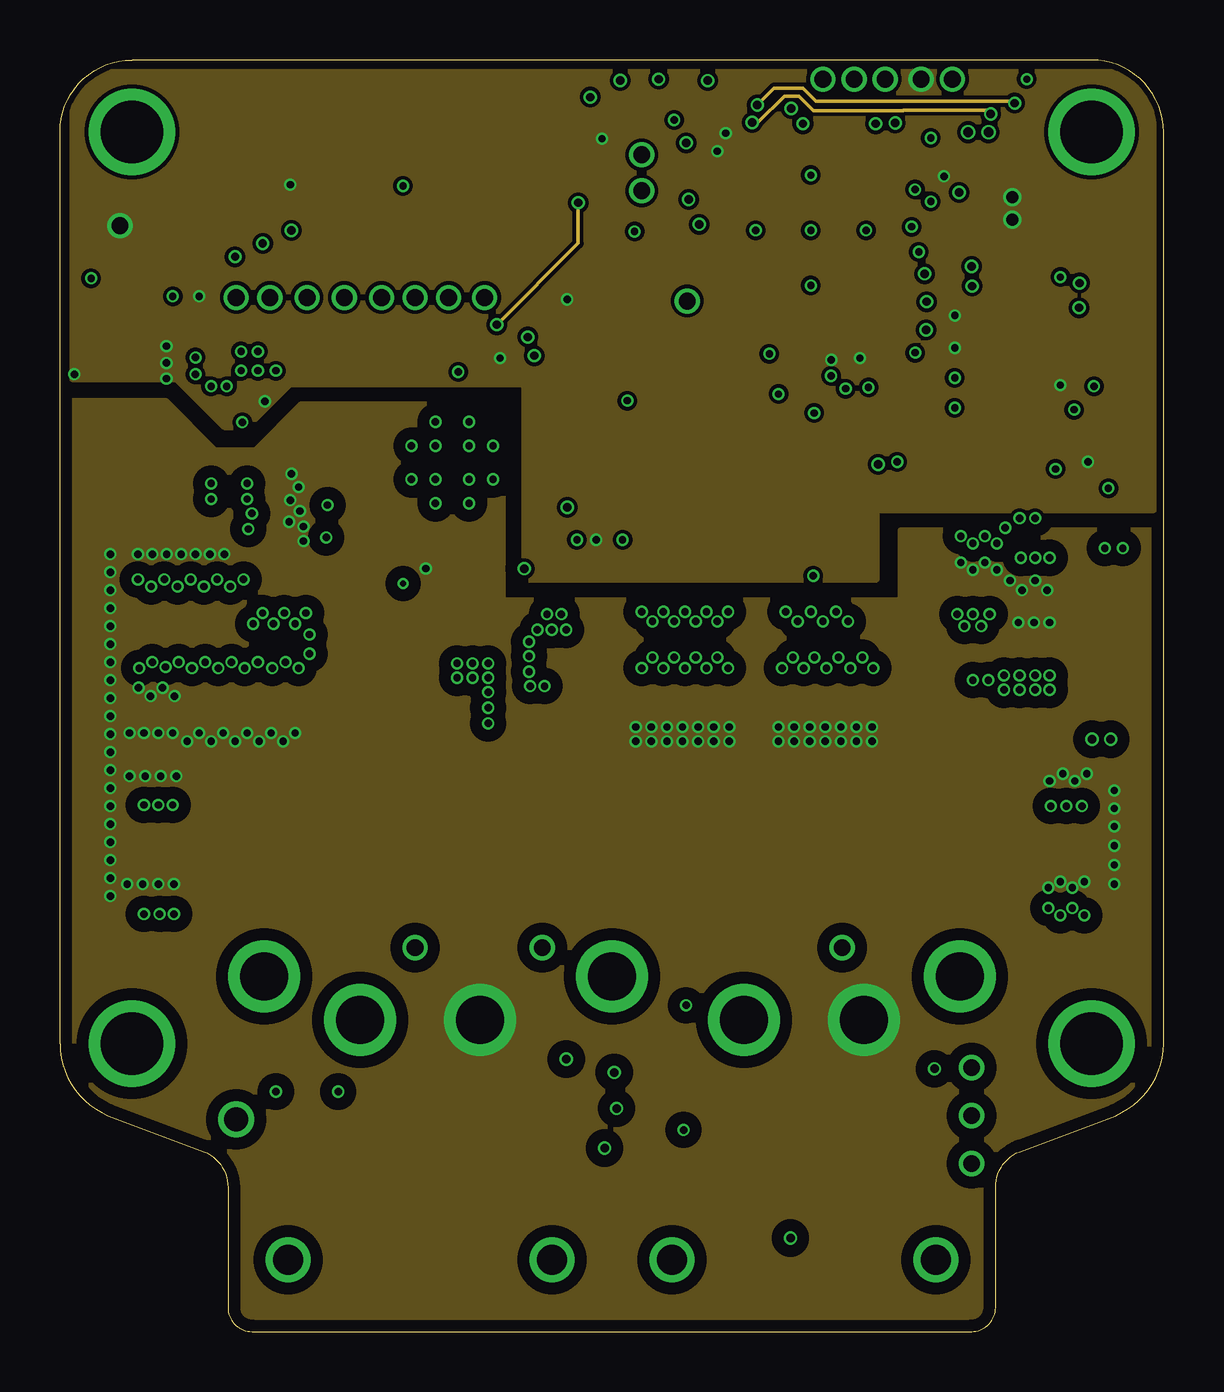
[diagram p7: board, inner layer Route15]
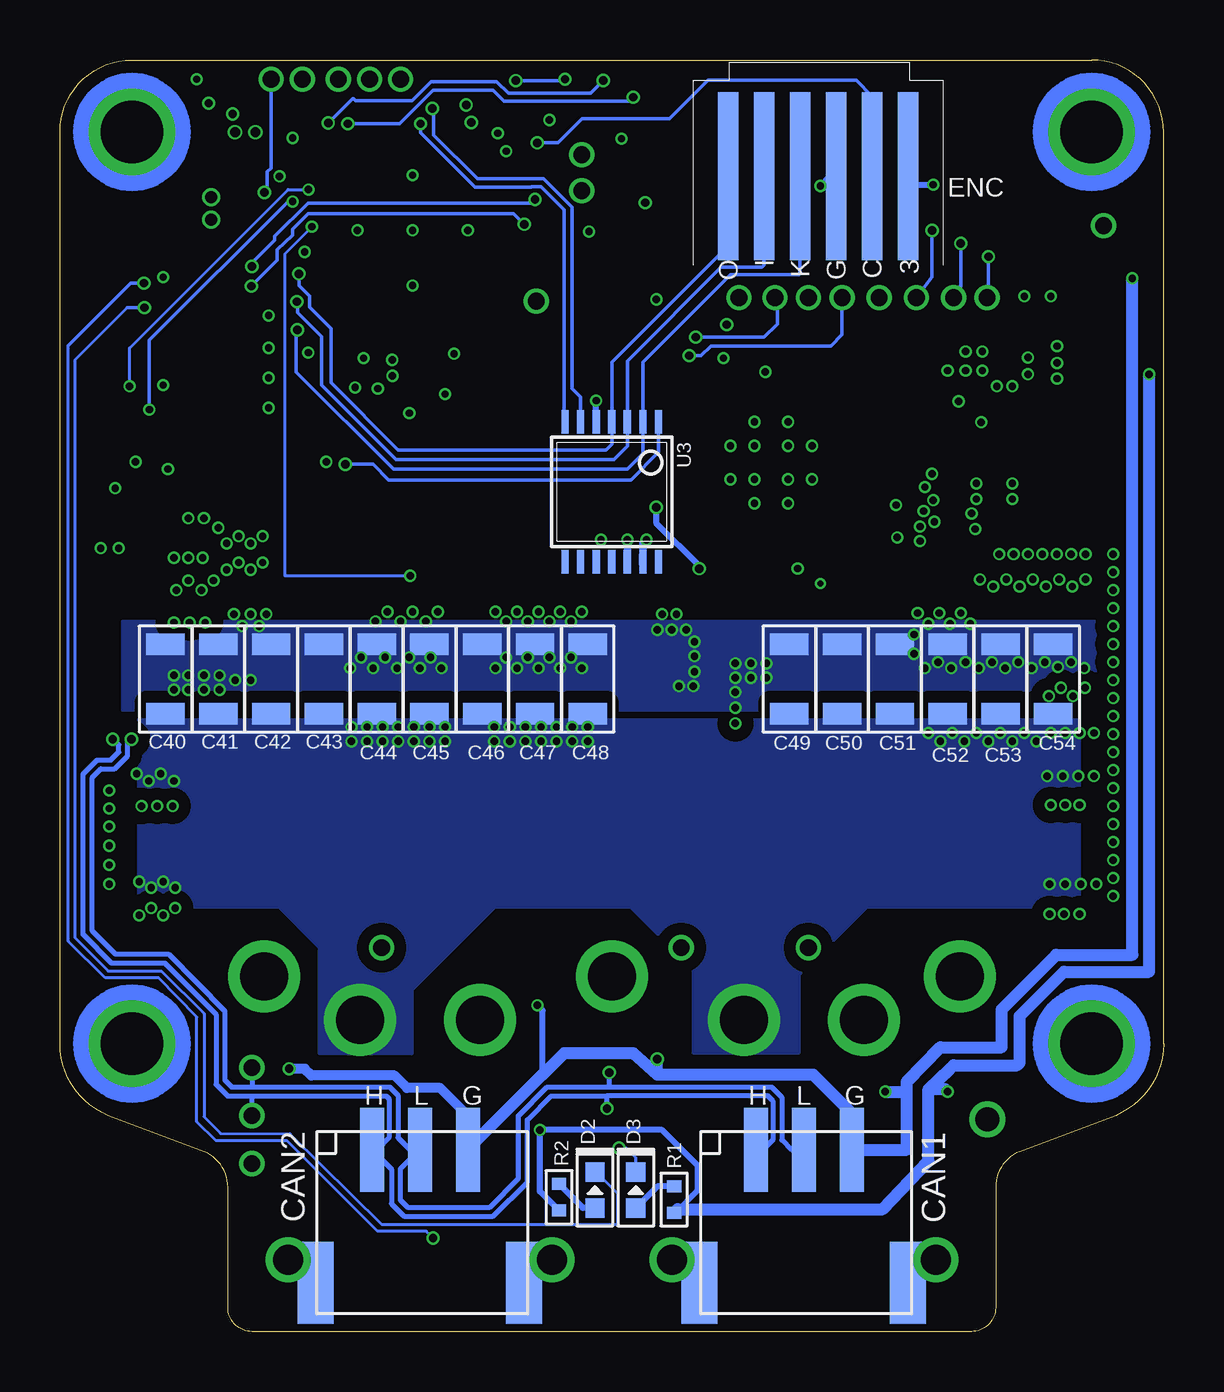
[diagram p8: board, bottom side, seen from below]

Size 46 x 53 mm. Coordinates in mm from the lower left corner, seen from the top.
Outline: 0,12 0,50 arc-90 3,53 43,53 arc-90 46,50 46,12 arc-67 44,9 40,7.5 arc68 39,6 39,1 arc-90 38,0 8,0 arc-90 7,1 7,6 arc68 6,7.5 2,9 arc-67 0,12
Copper layers (1*2*15*16): Top 0.035mm / dielectric 0.23mm / Route2 0.035mm / dielectric 0.93mm / Route15 0.035mm / dielectric 0.23mm / Bottom 0.035mm
Design rules "MF_4_mil_drill_4_Layer *": minimum track width 5mil, minimum drill 10mil, track to track 6mil, track to pad 6mil, pad to pad 6mil, via to via 6mil, smd to smd 0mil, copper to edge 10mil, drill to drill 10mil, minimum pad ring 4mil, minimum via ring 4mil, stop-mask expansion 2mil, vias tented up to drill 25mil, thermal gap 10mil

### Footprints (pad centres in the part's own frame; a part is rotated, then mirrored left to right if it is on the bottom)
16AWG_PAD = drill 2: 1 0,0
JST_S4B-ZR-SM4A-TF(LF)(SN) = smd 0.7 x 1.4: 1 2.25,-1.27; 2 0.75,-1.27; 3 -0.75,-1.27; 4 -2.25,-1.27 | smd 1.1 x 1.9: P1 4.2,2.48; P2 -4.2,2.48
C0402 = smd 0.5 x 0.6: P$1 -0.55,0; P$2 0.55,0
C1206 = smd 0.9 x 1.6: P$1 -1.45,0; P$2 1.45,0
C0603 = smd 0.6 x 0.9: P$1 -0.75,0; P$2 0.75,0
C1206_NOBORDER = smd 0.9 x 1.6: P$1 -1.45,0; P$2 1.45,0
C0805 = smd 0.7 x 1.3: P$1 -0.95,0; P$2 0.95,0
C1206_NOCREAM = smd 0.9 x 1.6: P$1 -1.45,0; P$2 1.45,0
JST_S3B-PH-SM4-TB(LF)(SN) = smd 1 x 3.5: 1 2,-2.98; 2 0,-2.98; 3 -2,-2.98 | smd 1.5 x 3.4: S1 -4.35,2.57; S2 4.35,2.57
LED0603 = smd 0.8 x 0.8: ANODE 0.75,0; CATHODE -0.75,0
SOT23-3 = smd 0.8 x 0.9: 1 -0.95,-1; 2 0.95,-1; 3 0,1
24AWG_PAD = drill 0.7: P$1 0,0
PICO-SPOX-SMT-RA-6-NOPASTE = smd 0.85 x 7: 1 3.75,0; 2 2.25,0; 3 0.75,0; 4 -0.75,0; 5 -2.25,0; 6 -3.75,0
XT30PW_MALE = drill 2: 1 -2.5,0; 2 2.5,0 | drill 1.25: M1 -5.5,10; M2 5.5,10
IND_BOURNS_SRN4018 = smd 1.499 x 3.607: 1 -1.524,0; 2 1.524,0
1812_COMMON_HALF = smd 1.75 x 1.3: P$1 -1.47,0; P$2 1.47,0
M2.5MOUNT = drill 2.6: P$1 0,0
SOP_ADVANCE_8 = smd 0.85 x 1.45: 1 -1.905,-2.95; 2 -0.635,-2.95; 3 0.635,-2.95; 4 1.905,-2.95 | smd 0.85 x 1.1: 5 1.925,2.75; 6 0.637,2.75; 7 -0.637,2.75; 8 -1.925,2.75 | smd 4.7 x 3.8: PAD 0,0.35
R0402 = smd 0.5 x 0.6: P$1 -0.55,0; P$2 0.55,0
M1206 = smd 1.6 x 2: 1 -1.4,0; 2 1.4,0
SHORT_TOP-50 = smd 0.254 x 0.254: 1 0.127,0; 2 -0.127,0
SHORT_TOP-MEDIUM = smd 0.635 x 0.635: 1 0.318,0; 2 -0.318,0
JST_S6B-ZR-SM4A-TF(LF)(SN) = smd 0.7 x 1.4: 1 3.75,0; 2 2.25,0; 3 0.75,0; 4 -0.75,0; 5 -2.25,0; 6 -3.75,0 | smd 1.1 x 1.9: P1 5.7,3.75; P2 -5.7,3.75
QFN50P700X700X60-49N = smd 0.85 x 0.3: 1 -3.45,2.75; 2 -3.45,2.25; 3 -3.45,1.75; 4 -3.45,1.25; 5 -3.45,0.75; 6 -3.45,0.25; 7 -3.45,-0.25; 8 -3.45,-0.75; 9 -3.45,-1.25; 10 -3.45,-1.75; 11 -3.45,-2.25; 12 -3.45,-2.75; 25 3.45,-2.75; 26 3.45,-2.25; 27 3.45,-1.75; 28 3.45,-1.25; 29 3.45,-0.75; 30 3.45,-0.25; 31 3.45,0.25; 32 3.45,0.75; 33 3.45,1.25; 34 3.45,1.75; 35 3.45,2.25; 36 3.45,2.75 | smd 0.3 x 0.85: 13 -2.75,-3.45; 14 -2.25,-3.45; 15 -1.75,-3.45; 16 -1.25,-3.45; 17 -0.75,-3.45; 18 -0.25,-3.45; 19 0.25,-3.45; 20 0.75,-3.45; 21 1.25,-3.45; 22 1.75,-3.45; 23 2.25,-3.45; 24 2.75,-3.45; 37 2.75,3.45; 38 2.25,3.45; 39 1.75,3.45; 40 1.25,3.45; 41 0.75,3.45; 42 0.25,3.45; 43 -0.25,3.45; 44 -0.75,3.45; 45 -1.25,3.45; 46 -1.75,3.45; 47 -2.25,3.45; 48 -2.75,3.45 | smd 5.7 x 5.7: 49 0,0
SOT23-8 = smd 0.45 x 1.1: 1 -0.975,-1.3; 2 -0.325,-1.3; 3 0.325,-1.3; 4 0.975,-1.3; 5 0.975,1.3; 6 0.325,1.3; 7 -0.325,1.3; 8 -0.975,1.3
TSSOP14 = smd 0.305 x 0.991: 1 -1.95,-2.918; 2 -1.3,-2.918; 3 -0.65,-2.918; 4 0,-2.918; 5 0.65,-2.918; 6 1.3,-2.918; 7 1.95,-2.918; 8 1.95,2.918; 9 1.3,2.918; 10 0.65,2.918; 11 0,2.918; 12 -0.65,2.918; 13 -1.3,2.918; 14 -1.95,2.918
21-0487A_MXM = smd 0.762 x 0.254: 1 -0.953,0.75; 2 -0.953,0.25; 3 -0.953,-0.25; 4 -0.953,-0.75; 5 0.953,-0.75; 6 0.953,-0.25; 7 0.953,0.25; 8 0.953,0.75
WQFN-40 = smd 0.22 x 0.6: 1 2.25,2.9; 2 1.75,2.9; 3 1.25,2.9; 4 0.75,2.9; 5 0.25,2.9; 6 -0.25,2.9; 7 -0.75,2.9; 8 -1.25,2.9; 9 -1.75,2.9; 10 -2.25,2.9; 21 -2.25,-2.9; 22 -1.75,-2.9; 23 -1.25,-2.9; 24 -0.75,-2.9; 25 -0.25,-2.9; 26 0.25,-2.9; 27 0.75,-2.9; 28 1.25,-2.9; 29 1.75,-2.9; 30 2.25,-2.9 | smd 0.6 x 0.22: 11 -2.9,2.25; 12 -2.9,1.75; 13 -2.9,1.25; 14 -2.9,0.75; 15 -2.9,0.25; 16 -2.9,-0.25; 17 -2.9,-0.75; 18 -2.9,-1.25; 19 -2.9,-1.75; 20 -2.9,-2.25; 31 2.9,-2.25; 32 2.9,-1.75; 33 2.9,-1.25; 34 2.9,-0.75; 35 2.9,-0.25; 36 2.9,0.25; 37 2.9,0.75; 38 2.9,1.25; 39 2.9,1.75; 40 2.9,2.25 | drill 0.305: P1 -0.7,-1.7; P2 0.7,-1.7; P3 1.7,-0.7; P7 0.7,-0.7; P8 0.7,1.7; P9 -0.7,1.7; P12 -0.7,-0.7; P13 0.7,0.7; P14 -0.7,0.7; P17 -1.7,-0.7; P18 1.7,0.7; P19 -1.7,0.7 | smd 4.15 x 4.15: PAD 0,0

### Placement (x,y rotation side)
A  8.5,14.8 0 top
ABS  41.9,41.7 270 top
B  23,14.8 0 top
C  37.5,14.8 0 top
C1  27.45,50.6 180 top
C2  36.3,48.7 90 top
C3  25.35,45.85 180 top
C4  31.55,40.42 270 top
C5  32.75,40.42 270 top
C6  33.98,40.42 270 top
C7  38.16,47.5 270 top
C8  10.3,10 0 top
C9  38.45,39.75 180 top
C10  38.45,38.5 180 top
C11  42.25,35.5 180 top
C12  22.9,32.02 0 top
C13  27.8,15.9 270 top
C14  14.77,31.7 270 top
C15  15.96,31.7 90 top
C16  13.08,31.7 90 top
C17  11.7,35.05 0 top
C18  17.2,40.65 0 top
C19  9,33.15 180 top
C20  9.75,38.6 90 top
C21  5,40.6 0 top
C22  6.73,27.2 90 top
C23  9.2,27.2 90 top
C24  24.8,27.4 90 top
C25  27.2,27.4 90 top
C26  30.8,27.4 90 top
C27  33.2,27.4 90 top
C28  4.14,27.19 90 top
C29  4.14,31.75 270 top
C30  4.15,22.55 270 top
C31  6.5,31.75 270 top
C32  4.15,18.05 270 top
C33  40.5,27.05 270 top
C34  40.5,31.6 90 top
C35  38.2,32.45 90 top
C36  41.85,22.55 270 top
C37  41.85,18.05 270 top
C38  11.7,33.8 0 top
C39  8,35.15 180 top
C40  41.6,27.2 90 bottom
C41  39.4,27.2 90 bottom
C42  37.2,27.2 90 bottom
C43  35,27.2 90 bottom
C44  32.8,27.2 90 bottom
C45  30.6,27.2 90 bottom
C46  28.4,27.2 90 bottom
C47  26.2,27.2 90 bottom
C48  24,27.2 90 bottom
C49  15.6,27.2 90 bottom
C50  13.4,27.2 90 bottom
C51  11.2,27.2 90 bottom
C52  9,27.2 90 bottom
C53  6.8,27.2 90 bottom
C54  4.6,27.2 90 bottom
C55  7.05,10.35 0 top
C56  5.25,42.4 180 top
C57  35.7,39.75 90 top
C58  28.5,40.55 0 top
C59  29.85,39.45 0 top
C60  30.35,38.35 0 top
CAN1  15,4.6 180 bottom
CAN2  31,4.6 180 bottom
D2  23.7,5.9 270 bottom
D3  22,5.9 270 bottom
D4  23,9.7 90 top
D33  2.5,46.1 0 top
DA  14.8,16 0 top
DAC  26.15,42.95 270 top
DB  20.1,16 0 top
DBG1  24.25,49.05 270 top
DBG2  24.25,47.55 270 top
DC  32.6,16 0 top
DG1  11.85,43.1 0 top
DG2  34.4,52.2 0 top
DRV_CS  13.4,43.1 0 top
DRV_MISO  17.7,43.1 0 top
DRV_MOSI  16.2,43.1 0 top
DRV_SCK  14.8,43.1 0 top
DTR  31.8,52.2 270 top
DTX  33.1,52.2 270 top
ENC  14.4,48.15 0 bottom
J1  31,13 180 top
J2  15,13 180 top
L1  3.7,37.05 270 top
L2  42.5,27.45 90 top
L3  44.23,27.45 90 top
M1  3,50 0 top
M2  43,50 0 top
M3  3,12 0 top
M4  43,12 0 top
MOT1  10.3,43.1 0 top
MOT2  8.75,43.1 0 top
MOT3  7.35,43.1 0 top
Q1  8,21 0 top
Q2  14,20.7 180 top
Q3  26,21 0 top
Q4  20,20.7 180 top
Q5  32,21 0 top
Q6  38,20.7 180 top
R1  20.4,5.5 90 bottom
R2  25.2,5.6 90 bottom
R3  38.45,42.35 0 top
R4  38.45,41 0 top
R5  36.29,37.42 270 top
R6  35.06,37.42 90 top
R7  39.1,52.2 0 top
R8  30.2,15.9 90 top
R9  29,15.9 270 top
R10  7.05,11.5 0 top
R13  19.55,43.05 180 top
R14  24.25,50.5 0 top
R15  26.3,40.55 0 top
R16  27.65,39.45 0 top
R17  28.15,38.35 0 top
RA  15.35,25.95 180 top
RB  20.85,26.7 270 top
RC  37.9,26.9 270 top
SH1  15.84,26.75 180 top
SH2  21.05,27.21 270 top
SH3  37.12,27.42 270 top
SH4  7.55,36.55 270 top
SWD  14.4,47.7 0 top
TEMP1  35.9,52.2 0 top
TEMP2  37.2,52.2 0 top
U1  31.3,45.9 0 top
U2  43.35,32.85 180 top
U3  23,35 180 bottom
U4  7.55,37.55 180 top
U5  16.35,36.22 180 top

### Tracks (layer width: path | path; a pad name or v marks a point on that pad's centre or on a via)
+3V3  (via drill 0.3, 0.5)
  Top 0.127: v42.85,36.25 42.85,35.55 | 42.85,35.55 42.85,34.15 U2.3 | 42.85,35.55 C11.P$1
  Top 0.216: U5.24 17.1,39.55 17.2,39.65 17.2,40.1 17.75,40.55 C18.P$2
  Top 0.254: SWD.6 10.55,47.7 10.46,47.79 10.46,47.8 v9.6,47.8 | v26,8.4 28.59,11 30.5,11 30.5,14.2 30.2,14.5 R8.P$1 | U1.23 33.55,41.4 C6.P$1 | U1.21 32.55,41.17 C5.P$1 | U1.20 32.05,41.47 C4.P$1 | U1.1 27.85,48.75 v27.4,49.2 | U1.48 28.55,49.83 28,50.33 C1.P$1 | U1.35 C2.P$1 35.6,48.85 35.6,51.9 TEMP1.P$1 | R14.P$1 23.37,50.5 v22.59,49.72 | R13.P$1 20.08,43.07 21.09,43.07 v21.14,43.02 | v41.7,39.45 ABS.1 39,39.45 C9.P$1 C10.P$1 | R3.P$1 v37.3,42.35 | R4.P$1 v37.3,41 | U4.4 8.54,38.34 v8.54,38.77
  Top 0.3: C1.P$1 28,50.05 27.82,50 27.79,49.99 v27.75,49.95 | C2.P$1 v36.85,48.15 | C6.P$1 33.74,40.97 v33.34,40.57 | v32.15,40.5 32.15,40.72 31.9,40.97 C4.P$1 C5.P$1
  Top 0.305: C12.P$1 22.35,32.42 22.35,32.45 v22.35,33 | C18.P$2 17.83,40.57 v18.34,40.57
  Top 0.406: C56.P$1 v5.8,43.15
  Top 0.5: C8.P$1 v9,10
  Bottom 0.254: R2.P$1 26,5.84 v26,8.4 20.9,8.4 19.4,6.9 19.4,5.9 20.35,4.95 R1.P$1 | ENC.1 10.3,47.8 v9.6,47.8
  Bottom 0.305: U3.12 v22.35,33
  Bottom 0.5: R1.P$1 20.25,5.1 11.7,5.1 9.8,7.1 9.8,10.1 | 9.8,10.1 8.9,10.95 8.75,11.1 6.1,11.1 6,11.2 6,13.15 4.15,15 0.6,15 v0.6,39.9 | v9,10 9.1,10.1 9.8,10.1
  other vias: 39.7,46.34 39.7,47.29 4.44,41.07 4.44,40.37 4.44,39.72
  pour Route15 (no thermals): 0.5,39.7 4.85,39.7 6.85,37.7 7.8,37.7 9.6,39.5 19.35,39.5 19.35,31.35 34.05,31.35 34.05,34.25 45.6,34.25 45.6,52.5 0.5,52.5
  pour Top (no thermals): 37.35,46.55 38.55,47.75 40.25,47.75 40.25,45.65 37.35,45.65
  pour Top (no thermals): 3.15,41.5 5.05,41.5 5.05,38.65 3.15,38.65
AS5047_A  (via drill 0.35)
  Top 0.152: U1.43 31,49.4 31,50.34 v30.97,50.34
  Bottom 0.127: 25,38 U3.7
  Bottom 0.152: v30.97,50.34 30.97,49.97 28.7,47.7 26.36,47.7 26.35,47.71 25.95,47.71 25,46.76 25,38
AS5047_B  (via drill 0.35)
  Top 0.152: U1.42 31.55,50.9 30.56,50.9 v30.48,50.98
  Bottom 0.152: v30.48,50.98 30.48,50.96 30.42,50.9 30.42,49.87 28.6,48.05 25.84,48.05 24.65,46.86 24.65,39.3 24.3,38.95 U3.6
AS5047_CS  (via drill 0.35)
  Top 0.152: v34.1,36.15 34.1,38.8 34.63,39.33 34.63,41.87 U1.24
  Bottom 0.152: U3.1 21.05,36.65 22.2,35.5 32.3,35.5 32.95,36.15 v34.1,36.15
AS5047_MISO  (via drill 0.35)
  Top 0.152: U1.27 35.15,44.15 36.12,43.18 v36.12,42.92
  Bottom 0.152: v36.12,42.92 36.1,42.91 36.1,42.47 35.1,41.47 35.1,39.45 32,36.35 22.9,36.35 22.35,36.9 U3.3 22.35,40.45 18.44,44.36 16.74,44.36 16.65,44.45 ENC.5
AS5047_MOSI  (via drill 0.35)
  Top 0.152: U1.28 35.4,44.65 35.96,44.09 v36.04,44.09
  Bottom 0.152: v36.04,44.09 36.04,43.59 35.6,43.15 35.6,42.7 34.7,41.8 34.7,39.55 31.91,36.75 23.25,36.75 23,37 U3.4 23,40.4 18.15,45.25 ENC.6
AS5047_SCK  (via drill 0.35)
  Top 0.152: U1.26 34.79,43.61 35.19,43.61 35.53,43.27 35.53,42.31 v36.1,41.75
  Bottom 0.152: v36.1,41.75 36.15,41.7 36.15,40 32.1,35.95 22.35,35.95 21.7,36.6 U3.2 21.7,40.4 18.05,44.05 15.2,44.05 15.15,44.1 ENC.4
CAN2_N
  Top 0.216: U2.6 43.02,30.57 43.17,30.43 43.17,29.59 L2.P$2
CAN2_P
  Top 0.216: U2.7 43.67,30.57 43.53,30.43 43.53,29.62 L3.P$2
CAN_N  (via drill 0.35, 0.7)
  Top 0.216: v43.02,24.69 43.02,25.46 L2.P$1
  Top 0.305: D4.2 23.75,10.8 v23.1,10.8
  Bottom 0.216: CAN1.2 15.51,7.58 15.91,7.98 15.91,9.77 16.33,10.19 23.06,10.19 | 38,10.2 38.85,10.2 39.13,10.48 39.13,13.36 41.47,15.74 43.69,15.74 44.65,16.69 44.65,23.1 44.3,23.45 43.73,23.45 43.18,24 43.18,24.52 v43.02,24.69 | 38,10.2 32.25,10.2 31.91,9.85 31.91,8.08 31.41,7.58 CAN2.2 31.81,6.77 31.81,5.49 31.51,5.19 28.08,5.19 26.89,6.38 26.89,8.99 25.69,10.19 23.06,10.19 | v38,11 38,10.2 | v23.1,10.8 23.1,10.23 23.06,10.19
CAN_P  (via drill 0.35, 0.7)
  Top 0.216: v43.8,24.69 43.8,25.55 L3.P$1
  Top 0.305: v23.2,9.3 23.2,8.75 D4.1
  Bottom 0.216: CAN1.1 16.69,7.58 16.29,7.98 16.29,9.61 16.49,9.81 23.21,9.81 | 38.04,9.82 39.02,9.82 39.5,10.3 39.5,13.21 41.64,15.36 43.86,15.36 45.04,16.54 45.04,23.23 44.45,23.82 43.88,23.82 43.55,24.15 43.55,24.45 43.78,24.68 v43.8,24.69 | 38.04,9.82 32.41,9.82 32.29,9.7 32.29,8.09 32.79,7.58 CAN2.1 32.19,6.77 32.19,5.33 31.66,4.8 27.94,4.8 26.51,6.23 26.51,8.83 25.53,9.81 23.21,9.81 | v38,9 38,9.78 38.04,9.82 | v23.2,9.3 23.2,9.8 23.21,9.81
CAN_RX  (via drill 0.3)
  Top 0.127: v36.3,47.1 36.3,47.12 34.75,47.12 U1.33 | v42.27,38.42 42.25,38.42 42.25,34.38 42.38,34.25 U2.4
  Bottom 0.152: v36.3,47.1 36.5,47.1 42.27,41.33 v42.27,38.42
CAN_TX  (via drill 0.3)
  Top 0.127: v35.64,47.6 34.75,47.6 U1.34 | v43.1,39.4 43.17,39.33 43.17,36.62 44.25,35.55 44.25,34.25 U2.1
  Bottom 0.127: v43.1,39.4 43.1,41 36.5,47.6 v35.64,47.6
CUR1
  Top 0.203: U5.23 17.6,39.65 18.01,40.06 24.16,40.06 24.65,40.55 R15.P$1
CUR2
  Top 0.203: U5.22 18.1,39.45 18.35,39.7 25,39.7 25.25,39.45 R16.P$1
CUR3
  Top 0.203: U5.21 18.79,39.31 24.49,39.31 25.45,38.35 R17.P$1
DAC
  Top 0.127: U1.12 27.8,43.2 26.6,43.2 26.6,42.95 DAC.P$1
DEBUG1
  Top 0.152: U1.3 26.9,47.65 25.5,49.05 DBG1.P$1
DEBUG2
  Top 0.152: U1.4 26.95,47.15 26.15,47.95 24.65,47.95 DBG2.P$1
DEBUG_RX
  Top 0.127: DTR.P$1 32.5,51.5 32.5,49.38 U1.40
DEBUG_TX
  Top 0.127: U1.39 33.12,49.38 33.12,52.12 DTX.P$1
DRV8323_CS  (via drill 0.35)
  Top 0.127: U1.16 30,42.38
  Top 0.152: U5.30 14.1,42.35 14.12,42.38 DRV_CS.P$1 | 30,42.38 30,41.88 29.23,41.1 20.2,41.1 v19.77,40.67
  Bottom 0.152: v19.77,40.67 19.27,40.67 18.88,41.08 13.88,41.08 13.4,41.55 DRV_CS.P$1
DRV8323_MISO
  Top 0.127: U1.14 29,42.38
  Top 0.152: U5.27 15.6,41.3 17.6,43.3 DRV_MISO.P$1 18.87,42.13 19.75,42.13 20.1,41.78 28.84,41.78 29,41.94 29,42.38
  Top 0.216: R13.P$2 17.75,43.05 DRV_MISO.P$1
DRV8323_MOSI  (via drill 0.35)
  Top 0.127: U1.15 29.5,42.38
  Top 0.152: U5.28 15.1,42.2 DRV_MOSI.P$1 | 29.5,42.38 29.5,41.85 29.09,41.45 v19.5,41.45
  Bottom 0.152: v19.5,41.45 16.65,41.45 16.1,42 16.1,43.2 DRV_MOSI.P$1
DRV8323_SCLK
  Top 0.127: U1.13 28.55,42.15
  Top 0.152: U5.29 14.6,43.1 DRV_SCK.P$1 15.6,44.1 19.1,44.1 19.55,43.66 19.55,42.77 19.55,42.76 19.55,42.45 19.9,42.45 20.18,42.15 28.55,42.15
FCUR1
  Top 0.152: C58.P$1 28.48,40.02 29.52,40.02 30.15,40.65 30.15,41.55 30.5,41.9 30.5,42.4
  Top 0.203: 30.5,42.4 U1.17 | R15.P$2 C58.P$1
FCUR2
  Top 0.152: C59.P$1 29.45,39.45 30.61,40.61 30.61,41.52 31.05,41.97 U1.18
  Top 0.203: C59.P$1 R16.P$2
FCUR3
  Top 0.152: C60.P$1 29.98,38.53 30.2,38.53 30.55,38.88 30.75,38.88 31,39.13 31,41.35 31.55,41.9 U1.19
  Top 0.203: C60.P$1 R17.P$2
GHA
  Top 0.254: Q1.4 9.9,18.41 10.8,19.3 10.8,25.7 11.35,26.25 11.36,29.74 12.37,30.62 16.48,30.62 16.6,30.8 U5.6
GHB
  Top 0.254: Q3.4 28.8,19.14 28.8,30.4 27.5,31.9 25.62,31.9 24.23,33.28 21.55,35.97 U5.15
GHC
  Top 0.254: Q5.4 34.8,18.95 34.8,29.1 31.4,32.5 25.86,32.5 21.89,36.47 U5.16
GLA
  Top 0.254: U5.8 17.55,33.27 17.55,30.35 16.84,29.64 13.64,29.64 12.51,28.51 12.51,24.06 Q2.4
GLB  (via drill 0.35)
  Top 0.254: U5.13 20.53,34.97 v21.15,34.35 | v19.35,31.8 19.35,30 18.7,29.35 18.7,24.75 18.09,24.14 Q4.4
  Bottom 0.254: v21.15,34.35 21.15,33.7 19.35,31.9 v19.35,31.8
GLC
  Top 0.254: Q6.4 35.63,24.11 35.63,29.97 32,33.6 26.32,33.6 22.45,37.47 U5.18
GND  (via drill 0.3, 0.35, 0.4, 0.7)
  Top 0.152: U1.38 33.55,48.6 33.15,48.2 v31.3,48.2
  Top 0.203: C58.P$2 29.37,40.55 v29.57,40.76 | C59.P$2 30.02,39.08 v29.95,39.08 | C60.P$2 31.38,38.35 v31.44,38.28
  Top 0.216: U2.5 42.38,32.64 v43.55,32.65 | U2.8 44.33,31.65 v44.3,32.65 | v16.6,40 U5.25
  Top 0.254: v26.1,13.6 26.5,13.6 27.8,14.9 C13.P$2 R9.P$2 | C3.P$2 v23.95,45.85 | ABS.4 v41.7,43.95 | C9.P$2 v37.3,39.75 | C10.P$2 v37.3,38.5 | C11.P$2 41.5,35.7 v41.5,35.95 | U2.2 43.7,34.17 v43.7,35.15 | R6.P$1 35.06,36.41 v34.9,36.25 | v14.3,47.75 13.7,47.75 SWD.4 | U1.29 35.65,45.15 v35.8,45 | C57.P$2 35.65,40.35 v35.65,40.8
  Top 0.3: C1.P$2 26.79,50.6 26.75,50.5 v25.6,50.5 | v36.3,49.75 C2.P$2 | C5.P$2 v32.75,39.3 | C6.P$2 33.84,39.53 v33.7,39.35
  Top 0.305: C12.P$2 v23.45,33 | C20.P$2 9.45,39.35 | v32.14,39.84 31.59,39.84 C4.P$2 | C18.P$1 16.65,40.05 v16.6,40
  Top 0.406: v36.45,10.95 36.8,10.6 36.8,6.95 37.95,6.95 v38,7 | D4.3 22,10.45 v21.1,11.35 | C56.P$2 v4.7,43.15
  Top 0.5: C8.P$2 v11.6,10 | R7.P$2 v40.3,52.2
  Bottom 0.254: 25.88,10.7 25.88,10.73 25.88,13.38 v26.1,13.6 | U3.5 v23.65,38.8 | ENC.3 13.9,48.15 v14.3,47.75
  Bottom 0.305: U3.13 21.72,32 21.69,32.87 v21.55,33
  Bottom 0.406: CAN2.3 29,9 30.15,10.15 31.53,10.15 32.05,10.67 35.52,10.67 35.8,10.95 v36.45,10.95 | v21.1,11.35 21.1,10.7
  Bottom 0.5: 10.7,10 10.7,7.58 CAN1.3 13,9.1 14.6,10.7 21.1,10.7 22.1,11.6 24.98,11.6 25.88,10.7 | 10.7,10 10.7,10.4 9.29,11.85 6.75,11.85 6.75,13.43 4.48,15.7 1.3,15.7 v1.3,43.9 | v11.6,10 10.7,10 | CAN2.3 29,7.6 25.88,10.73
  other vias: 38.7,49.99 37.85,49.99 31.3,45.9 29,45.9 31.3,43.6 33.6,45.9 5.65,39.9 6.3,39.4 6.95,39.4 7.6,37.9 5.65,40.6 7.55,40.85 7.55,40.05 8.25,40.85 8.25,40.05 9,40.05
  pour Route2 (rank 2, no thermals): 0.5,39.7 4.6,39.7 6.8,37.5 7.8,37.5 9.7,39.4 19.25,39.4 19.25,31.35 32.82,31.35 35.45,33.95 36.2,34.7 36.6,35.1 41,35.1 42.15,33.95 43.2,33.95 43.2,31.65 45.4,31.65 45.4,52.5 0.5,52.5
  pour Top (no thermals): 38.95,48.59 37.35,48.59 37.35,50.39 38.95,50.39
  pour Top (no thermals): 6.2,37.4 7.2,37.4 7.2,38.1 7.8,38.1 7.8,36.8 7.3,36.8 7.3,37.2 6.2,37.2
  pour Top (no thermals): 5.4,41.5 8.15,41.5 8.15,40.5 7.9,40.25 7.9,38.8 6.45,38.8 5.4,39.85
  pour Top (no thermals): 6.05,39.25 6.5,38.8 7.1,38.8 7.25,38.65 7.25,38 7.85,38 7.85,38.7 7.45,39.1 7.45,39.25
  pour Top (no thermals): 8.2,41.5 10.1,39.6 10.1,38.95 9.15,38.95 8.8,39.3 7.4,39.3 6.85,39.85 6.85,40.15
I2C_ABS_SCL  (via drill 0.35)
  Top 0.127: R4.P$2 40.62,41 ABS.2
  Top 0.152: ABS.2 42.6,40.95 43.78,42.13 43.78,44.07 40.86,46.99 40.86,48.09 39.9,49.05 39.9,51.1 v39.8,51.2 | v29.07,51.13 29.35,50.85 29.35,50.49 29.5,50.35 29.5,49.41 U1.46
  Route15 0.152: v39.8,51.2 39.8,51.28 31.52,51.28 30.97,51.83 29.77,51.83 v29.07,51.13
I2C_ABS_SDA  (via drill 0.35)
  Top 0.127: R3.P$2 39,42.38 40.62,42.38 ABS.3 | 29.12,49.38 U1.47
  Top 0.152: ABS.3 41.8,42.45 42.25,42 42.85,42 43.45,42.6 43.45,43.85 40.55,46.75 40.55,47.9 39.5,48.95 39.5,50.05 v38.8,50.75 | v28.85,50.4 29.12,50.12 29.12,49.38
  Route15 0.152: v38.8,50.75 38.65,50.9 35.16,50.9 35.16,50.89 31.41,50.89 30.8,51.5 30.2,51.5 29.1,50.4 v28.85,50.4
LED1  (via drill 0.35)
  Top 0.127: v22.7,7.65 22.8,7.55 26.4,7.55 30.05,3.9 v30.45,3.9
  Top 0.152: U1.5 27,46.65 26.81,46.83 26.72,46.83 26.37,47.18 v26.2,47.18 | v38,44.4 38.05,44.35 38.4,44.35 39.39,43.37 42.16,43.37 v42.5,43.7
  Bottom 0.127: D3.CATHODE 22,7.25 22.4,7.65 v22.7,7.65 | v30.45,3.9 30.73,4.18 32.77,4.18 36.54,7.95 39.5,7.95 40.3,8.75 40.3,13.11 41.89,14.75 44.11,14.75 45.65,16.27 45.65,41.1
  Bottom 0.152: v26.2,47.18 26.35,47.03 35.66,47.03 37.05,45.65 37.05,45.5 38,44.55 v38,44.4 | v42.5,43.7 43.05,43.7 45.65,41.1
LED2  (via drill 0.35)
  Top 0.152: U1.6 27,46.15 26.82,46.33 v26.65,46.15 | v38.02,43.58 38.33,43.58 38.85,43.05 42.1,43.05 v42.48,42.67
  Bottom 0.127: D2.CATHODE 23.62,6.62 22.75,5.75 22.75,4.47 32.59,4.47 36.4,8.23 36.42,8.25 39.3,8.25 40,8.95 40,13.25 41.77,15.03 43.99,15.03 45.37,16.41 45.37,40.51 43.2,42.67
  Bottom 0.152: v38.02,43.58 36.94,44.66 36.96,45.09 36.3,45.7 36.3,45.95 35.65,46.6 27.1,46.6 v26.65,46.15 | 43.2,42.67 v42.48,42.67
MOTOR1  (via drill 0.35)
  Top 0.152: U5.32 12.16,37.97 12.16,41.08 MOT1.P$1 | v9.65,45.9 20.15,45.9 20.9,45.15 U1.8
  Bottom 0.152: v9.65,45.9 9.65,43.95 MOT1.P$1
MOTOR2  (via drill 0.35)
  Top 0.152: U5.34 11.38,36.97 11.38,40.02 8.75,42.65 MOT2.P$1 | U1.9 20.5,44.65 19.8,45.35 v8.45,45.35
  Bottom 0.152: MOT2.P$1 8.45,43.6 v8.45,45.35
MOTOR3  (via drill 0.35)
  Top 0.152: U5.36 11.58,35.97 11,36.55 11,39.45 MOT3.P$1 | U1.10 20.15,44.15 19.5,44.8 v7.3,44.8
  Bottom 0.152: MOT3.P$1 7.3,43.35 v7.3,44.8
MOTOR_ENABLE
  Top 0.152: U1.11 27.75,43.75 20.1,43.75 19.4,44.45 13.42,44.45 12.62,43.65 12.62,39.3 U5.31
MOTOR_FAULT  (via drill 0.35)
  Top 0.127: 24.62,50.5 R14.P$2
  Top 0.152: U5.26 16.1,41.15 16.9,41.95 18.21,41.95 v18.21,41.97 | 24.62,50.5 21.6,47.48 v21.6,47.05 | U1.44 30.47,49.43 30.47,50.25 29.97,50.75 29.97,52.57 29.87,52.67 26.6,52.67 24.8,50.87 R14.P$2
  Route15 0.152: v18.21,41.97 21.6,45.36 v21.6,47.05
MOTOR_HIZ  (via drill 0.35)
  Top 0.152: U5.37 13.77,35.47 14,35.7 14,36.2 13.73,36.47 | 13.73,36.47 U5.35 | 13.73,36.47 14,36.74 14,37.3 13.83,37.47 U5.33 11.76,37.47 11.76,40.48 9.53,42.71 9.53,43.75 9.1,44.18 6.45,44.18 6.45,47.17 11.95,52.67 23.86,52.67 24.33,52.2 v24.95,52.2 | U1.45 30.05,50.23 29.66,50.62 29.66,52.33 29.65,52.34 27.2,52.34 v27,52.14
  Bottom 0.152: v27,52.14 25.16,52.14 25.1,52.2 v24.95,52.2
N$1
  Top 0.305: M3.P$1 3.5,11.5 R10.P$1 C55.P$1
N$2
  Top 0.305: U5.40 13.28,33.8 C38.P$2
N$4
  Top 0.203: C20.P$1 9.7,37.8
  Top 0.254: 9.7,37.8 U4.3
N$10
  Top 0.254: C16.P$2 13.11,32.25 13.11,32.33 U5.1
N$13
  Top 0.254: U5.2 14.6,33.03 14,32.44 14,32.05 13.1,31.15 C16.P$1
N$14
  Top 0.254: C15.P$2 16.1,32.39 U5.5
N$16
  Top 0.254: C17.P$2 12.33,34.97 U5.38
N$17
  Bottom 0.254: R1.P$2 21.1,6.05 D3.ANODE
N$18
  Bottom 0.254: D2.ANODE 24.2,5.15 R2.P$2
NRST
  Top 0.127: U1.7 27.75,45.62 25.9,45.62 C3.P$1 | SWD.2 16.75,47.62
  Top 0.152: 16.75,47.62 17.98,46.4 25.35,46.4 C3.P$1
SECONDARY_ENC_CS  (via drill 0.35)
  Top 0.152: U1.2 27.35,48.15 26.1,49.4 v26.1,49.55
  Bottom 0.152: v26.1,49.55 25.25,49.55 24.25,50.55 20.6,50.55 19,52.15 12.8,52.15 12.15,51.5 ENC.2
SHA
  Top 0.254: Q2.PAD 13.65,20.35 11.3,22.7 11.3,25.2 11.95,25.85 11.95,29.23 12.89,30.1 16.7,30.1 17.1,30.6 U5.7
  pour Top (no thermals): 5.7,18.7 9.1,18.7 9.1,17.3 9.3,17.1 10.5,17.1 11,17.6 11,18.7 16.3,18.7 16.3,14.8 11.4,14.8 9.35,12.75 7.65,12.75 5.7,14.7
SHB
  Top 0.254: Q4.8 23.15,18.89 23.15,31.2 22.9,31.45 22.9,33.8 21.23,35.47 U5.14
  pour Top (no thermals): 17.6,18.7 27.1,18.7 27.1,14.8 25.9,14.8 23.85,12.75 21.57,12.75 19.85,14.8 17.6,14.8
SHC
  Top 0.254: Q6.5 35.85,17.95 35.21,18.59 35.21,29.59 31.7,33.1 26.1,33.1 22.23,36.97 U5.17
  pour Top (no thermals): 29.7,18.7 33.1,18.7 33.1,17.1 34.5,17.1 34.9,17.5 34.9,17.9 35.7,18.7 40.3,18.7 40.3,14.8 38.25,12.75 36.55,12.75 34.5,14.8 30.8,14.8 30.8,16.9 30.3,17.3 29.7,17.3
SWCLK  (via drill 0.35)
  Top 0.127: 12.25,48.1 12.25,47.75 SWD.5
  Top 0.152: v34,50.34 34.05,50.34 U1.37 | v22.1,51.45 20.65,50 14.15,50 12.25,48.1
  Bottom 0.152: v34,50.34 31.85,50.34 30.44,51.75 27.95,51.75 27.48,51.28 22.27,51.28 v22.1,51.45
SWDIO  (via drill 0.35)
  Top 0.127: 15.25,47.75 SWD.3
  Top 0.152: v34.82,50.37 34.75,50.37 U1.36 | v23.35,52.15 23.35,51.95 20.9,49.5 17,49.5 15.25,47.75
  Bottom 0.152: v34.82,50.37 33.81,51.38 33.75,51.38 33.67,51.3 31.32,51.3 30.52,52.1 27.8,52.1 27.31,51.61 23.89,51.61 v23.35,52.15
SXA_N
  Top 0.254: U5.10 18.6,32.51 18.55,32.47 18.55,29.93 17.37,28.74 16.24,28.74 15.5,28 15.5,26.95 SH1.1
SXA_P
  Top 0.254: U5.9 18.1,32.51 18.15,32.47 18.15,30.1 17.2,29.15 16.07,29.15 15.09,28.17 15.09,26.94 14.9,26.75 14.1,26.75 14.1,25.95 RA.2
  pour Top (isolate 0.5, no thermals): 13,22.9 13,25.7 15.65,25.7 15.65,22.9
SXB_N
  Top 0.254: U5.11 20.06,33.97 20.55,33.48 20.55,31.88 22.19,30.24 22.19,27.19 21.9,26.9 21.23,26.9 SH2.1
SXB_P
  Top 0.254: U5.12 20.13,34.47 20.96,33.65 20.96,32.09 22.59,30.46 22.59,27.02 22.07,26.49 21.5,26.49 20.85,25.84 RB.2
  pour Top (isolate 0.5, no thermals): 19,24 19.7,24.7 19.7,25.5 22.3,25.5 22.3,23 19,23
SXC_N
  Top 0.254: U5.20 20.06,38.47 20.11,38.42 22.85,38.42 26.68,34.6 32.73,34.6 36.51,30.82 36.51,27.39 36.78,27.12 37.02,27.19 SH3.1
SXC_P
  Top 0.254: U5.19 20.06,37.97 20.11,38.02 22.68,38.02 26.51,34.19 32.56,34.19 36.05,30.7 36.05,27.23 36.75,26.52 36.88,26.52 RC.2
  pour Top (isolate 0.5, no thermals): 36.9,22.9 36.9,26.2 38.9,26.2 38.9,24.8 40.3,24.8 40.3,22.9
V+  (via drill 0.3)
  Top 0.127: R5.P$2 36.45,36.55 37,36 37,31.98 37.48,31.98 v37.55,32.05
  Top 0.254: v10.15,32.95 9.75,32.95 C19.P$1 | v15.25,31.8 15.31,31.8 C15.P$1 15.92,31.15 14.82,32.25 C14.P$1 | C14.P$1 15.1,32.58 U5.3 | U5.4 15.6,33.08 C14.P$1
  other vias: 24,25.2 29.95,25.2 5.8,24.95 3.25,32.4 3.27,26.84 4.85,23.15 4.75,18.65 39.6,31.3 39.95,29.55 41.25,22.95 41.2,18.5 2.1,32.4 43.95,18.65 9.65,35.75 24,24.6 24.65,25.2 24.65,24.6 25.3,25.2 25.3,24.6 25.95,25.2 25.95,24.6 26.6,25.2 26.6,24.6 27.25,25.2 27.25,24.6 27.9,25.2 27.9,24.6 29.95,24.6 30.6,25.2 30.6,24.6 31.25,25.2 31.25,24.6 31.9,25.2 31.9,24.6 32.55,25.2 32.55,24.6 33.2,25.2 33.2,24.6 33.85,25.2 33.85,24.6 38.05,31.75 38.55,32.05 39.05,31.75 40.1,30.9 40.65,31.3 41.15,30.9 40.6,29.55 41.25,29.55 41.8,23.25 42.3,22.95 42.8,23.25 41.7,18.75 42.2,18.5 42.7,18.75 43.95,19.45 43.95,20.25 43.95,21.05 43.95,21.8 43.95,22.55 3.85,32.4 4.45,32.4 5.05,32.4 5.65,32.4 6.25,32.4 6.85,32.4 3.77,26.48 4.27,26.84 4.77,26.48 6.3,24.6 6.8,24.95 7.3,24.6 7.8,24.95 8.3,24.6 8.8,24.95 9.3,24.6 9.8,24.95 2.1,31.65 2.1,30.9 2.1,30.15 2.1,29.4 2.1,28.65 2.1,27.9 2.1,27.15 2.1,26.4 2.1,25.65 2.1,24.9 2.1,24.15 2.1,23.4 2.1,22.65 2.1,21.9 2.1,21.15 2.1,20.4 2.1,19.65 2.1,18.9 2.1,18.15 4.2,23.15 3.55,23.15 2.9,23.15 4.1,18.65 3.45,18.65 2.8,18.65 9.95,35.2 9.6,34.65 10,34.2 9.55,33.75 10.15,33.55 5.3,24.6 4.7,24.95 4.1,24.95 3.5,24.95 2.9,24.95
  pour Route15 (isolate 0.5, no thermals): 0.5,0.5 0.5,38.8 4.4,38.8 6.45,36.75 8.15,36.75 10.05,38.65 18.45,38.65 18.45,30.5 35.05,30.5 35.05,33.4 45.6,33.4 45.6,0.5
  pour Top (no thermals): 23.7,23.1 23.7,26.5 28.2,26.5 28.3,26.5 28.3,23.1
  pour Top (no thermals): 29.7,23.1 29.7,26.5 33.9,26.5 34.3,26.5 34.3,23.1
  pour Top (isolate 0.5, no thermals): 5.7,23.1 5.7,26.6 9.9,26.6 10.3,26.6 10.3,23.1
  pour Top (isolate 0.5, no thermals): 0.2,27.1 5.4,27.1 5.4,22.7 0.2,22.7
  pour Top (no thermals): 5.35,26.6 7.1,26.6 7.1,19.5 5.35,19.5
  pour Bottom (isolate 0.5, no thermals): 3.5,25.5 42.75,25.5 42.75,17.7 3.5,17.7
  pour Top (no thermals): 0.25,33.65 7.25,33.65 7.35,33.55 7.35,32 0.25,32
  pour Top (isolate 0.5, no thermals): 0.2,20.25 7,20.25 7,19.3 5,19.3 5,18.2 0.2,18.2
  pour Top (isolate 0.5, no thermals): 0.3,33.85 2.7,33.85 2.7,17.75 0.3,17.75
  pour Top (isolate 0.5, no thermals): 37.35,32.35 38.9,32.35 39.75,31.5 41.4,31.5 41.4,29.7 40.5,29.7 39.45,30.75 37.35,30.75
  pour Top (isolate 0.5, no thermals): 39.8,30 41.55,30 43.5,28.05 43.5,27.85 39.8,27.85
  pour Top (isolate 0.5, no thermals): 41,24.05 45.45,24.05 45.45,22.75 41,22.75
  pour Top (isolate 0.5, no thermals): 41,20.05 45.45,20.05 45.45,18.3 41,18.3
  pour Top (isolate 0.5, no thermals): 41.9,26.85 41.9,26.05 43.5,24.45 43.5,17.95 45.75,17.95 45.75,26.85
  pour Top (isolate 0.5, no thermals): 8.8,35.95 10.15,35.95 10.15,33.95 8.8,33.95
  pour Top (no thermals): 9.05,34.2 10.35,34.2 10.35,32.7 8.95,32.7 8.95,34.1
  pour Top (no thermals): 8.21,37.36 8.89,37.36 8.89,36.95 9.95,35.9 9.95,35.75 8.7,35.75 8.65,35.8 8.65,36.27 8.21,36.7
  pour Bottom (isolate 0.5, no thermals): 6.15,18.1 11.95,18.1 15.2,14.85 15.2,11.6 19.6,11.6 19.6,15.05 23.75,19.2 23.75,19.55 23.7,19.6 6.2,19.6 6.2,18.15
  pour Bottom (isolate 0.5, no thermals): 27.7,19.35 36.9,19.35 37,19.25 37,17.8 35.2,16 35.2,11.6 31.3,11.6 31.3,14.25 27.7,17.85
V-  (via drill 0.25, 0.3, 1)
  Top 0.127: RC.1 37.12,28.3 SH3.2
  Top 0.216: U5.39 15.6,34.47
  Top 0.254: C19.P$2 8.15,33.45 v7.85,33.45 | C14.P$2 14.33,31.15 v14.3,31.18 | U5.PAD U5.P14 | 15.6,34.47 U5.P8 | SH2.2 20.85,27.54 RB.1 | v16.55,27.25 16.75,27.05 RA.1 16.46,26.24 SH1.2
  Top 0.305: C38.P$1 11.15,33.15 v11.1,33.1 | R10.P$2 C55.P$2 7.6,9.1 v7.35,8.85 | C17.P$1 v11.15,34.45
  other vias: 17.85,27.25 3.25,31.35 4.7,21.95 4.75,17.4 37.55,33.15 41.3,21.9 41.2,17.65 30.1,27.65 10.4,29.05 24.25,30 30.25,30 7.8,34.7 7.8,35.35 6.3,34.7 6.3,35.35 17.2,27.25 17.85,26.65 17.85,25.35 17.85,26 16.55,27.85 17.2,27.85 17.85,27.85 20.2,26.9 19.6,26.9 19.9,29.25 20.5,29.25 20.9,29.9 19.55,28.75 21.1,29.25 37.4,29.9 38.75,29.9 37.7,29.4 38.4,29.4 38.05,27.15 38.7,27.15 39.35,27.35 39.35,26.75 40,27.35 40,26.75 40.65,27.35 40.65,26.75 41.25,27.35 41.25,26.75 24.7,29.6 25.15,30 25.6,29.6 26.05,30 26.5,29.6 26.95,30 27.4,29.6 27.85,30 24.25,27.65 24.7,28.1 25.15,27.65 25.6,28.1 26.05,27.65 26.5,28.1 26.95,27.65 27.4,28.1 27.85,27.65 38.05,32.85 38.55,33.15 39.05,32.85 39.4,33.5 40,33.9 40.65,33.9 41.25,32.25 40.65,32.25 40.05,32.25 41.95,21.9 42.6,21.9 41.7,17.35 42.2,17.65 42.7,17.35 30.55,28.1 31,27.65 31.45,28.1 31.95,27.65 32.45,28.1 32.95,27.65 33.45,28.1 33.9,27.65 30.75,29.6 31.3,30 31.8,29.6 32.35,30 32.85,29.6 10.25,29.95 9.8,29.5 9.35,29.95 8.9,29.5 8.45,29.95 8.05,29.5 10.4,28.25 9.95,27.65 9.4,27.9 8.85,27.65 8.25,27.9 7.7,27.65 7.15,27.9 6.6,27.65 6.05,27.9 5.5,27.65 4.95,27.9 4.4,27.7 3.85,27.9 3.3,27.65 3.8,31.05 4.35,31.35 4.9,31.05 5.45,31.35 6,31.05 6.55,31.35 7.1,31.05 7.65,31.35 4.1,21.95 3.5,21.95 4.15,17.4 3.5,17.4 19.55,27.5 19.55,28.15 20.3,29.9 38.05,29.9 8,34.1
  pour Route2 (isolate 0.5, no thermals): 0.5,0.5 0.5,38.9 4.6,38.9 6.65,36.85 7.9,36.85 9.8,38.75 18.6,38.75 18.6,30.5 33.3,30.5 36.1,33.3 37.03,34.3 40.45,34.3 41.45,33.3 42.65,33.3 42.65,30.85 45.45,30.85 45.45,0.5
  pour Top (isolate 0.5, no thermals): 37,30.1 37,26.6 38.95,26.6 38.95,30.1
  pour Top (isolate 0.5, no thermals): 5.8,30.2 10.8,30.2 10.8,27.4 5.8,27.4
  pour Top (isolate 0.5, no thermals): 24,30.25 28.2,30.25 28.2,27.3 24,27.3
  pour Top (isolate 0.5, no thermals): 29.85,27.3 29.85,30.25 33,30.25 34.1,29.15 34.1,27.3
  pour Bottom (isolate 0.5, no thermals): 1.8,25.9 1.8,29.6 43.4,29.6 43.4,25.9
  pour Top (no thermals): 3.05,31.6 7.9,31.6 7.9,27.4 3.05,27.4
  pour Top (isolate 0.5, no thermals): 3.05,22.4 4.95,22.4 4.95,20.65 3.05,20.65
  pour Top (isolate 0.5, no thermals): 3.25,17.9 5,17.9 5,16.2 3.25,16.2
  pour Top (isolate 0.5, no thermals): 37.35,34.3 40.55,34.3 41.35,33.5 41.35,31.9 40.1,31.9 39.25,32.75 37.35,32.75
  pour Top (isolate 0.5, no thermals): 38.9,27.55 41.55,27.55 41.55,25.2 39.3,25.2 39.3,26.6 38.9,26.6
  pour Top (isolate 0.5, no thermals): 41,22.35 42.85,22.35 42.85,20.65 41,20.65
  pour Top (no thermals): 41,17.85 43,17.85 43,16.05 41,16.05
  pour Top (isolate 0.5, no thermals): 6,35.35 6.6,35.95 8.25,35.95 8.25,34.35 6,34.35
  pour Top (no thermals): 6.95,34.5 8.25,34.5 8.3,34.45 8.3,33.95 8.3,33.9 8.6,33.6 8.6,33.2 7.7,33.2 7.65,33.25 7.65,33.85 7.55,33.95 6.95,33.95
  pour Top (isolate 0.5, no thermals): 15.85,27.85 16.09,28.09 18.2,28.1 18.2,25.2 17.7,24.7 16.05,24.7 16.05,26.9 15.85,27.1
  pour Top (isolate 0.5, no thermals): 19.25,29.05 19.5,29.3 20.18,30.11 21.35,30.11 21.35,29.9 21.75,29.5 21.75,27.45 20.7,27.45 20.7,26.35 19.25,26.35
VBAT_SENSE
  Top 0.254: R5.P$1 R6.P$2 35.06,38.56 C57.P$1 35,39.9 35,42.9 U1.25
VSW
  pour Top (no thermals): 3.15,36.85 6.9,36.85 6.9,36.4 6.25,36.4 5.45,35.6 3.15,35.6
VTEMP_FET  (via drill 0.3)
  Top 0.127: 29,16.5 27.88,16.5 C13.P$1 | 29,16.5 29.38,16.5 | 29.38,16.5 30.12,16.5 R8.P$2 | 29,16.5 R9.P$1 | v35.5,46.05 35.5,46.12 34.75,46.12 U1.31 | v31.4,31.5 30.4,31.5 29.38,30.48 29.38,16.5
  Bottom 0.127: v35.5,46.05 36.62,44.92 36.62,31.5 v31.4,31.5
VTEMP_MOT  (via drill 0.35)
  Top 0.127: R7.P$1 38.5,52.25 37.25,52.25 TEMP2.P$1
  Top 0.152: v37.48,47.48 37.48,47.18 36.41,46.11 36.41,46.05 35.9,45.54 34.86,45.54 U1.30
  Bottom 0.152: TEMP2.P$1 37.2,48.5 37.36,48.34 37.36,47.6 v37.48,47.48

### Text on the board
tPlace: SER | R | T | G | TEMP | DBG | 1 | 3 | 3V | 2 | MOT | SPI | DAC | 3 | 2 | 1 | G | C | K | MO | MI | moteus r4.8 | (c) 2021 | A | B | C | CAN | L | H | G
tNames: G | 3
bNames: 3 | C | G | K | I | O | G | L | H | G | L | H